# EasyEDA Pro project 蓝桥4ASCII-1.epro, board 蓝桥4ASCII
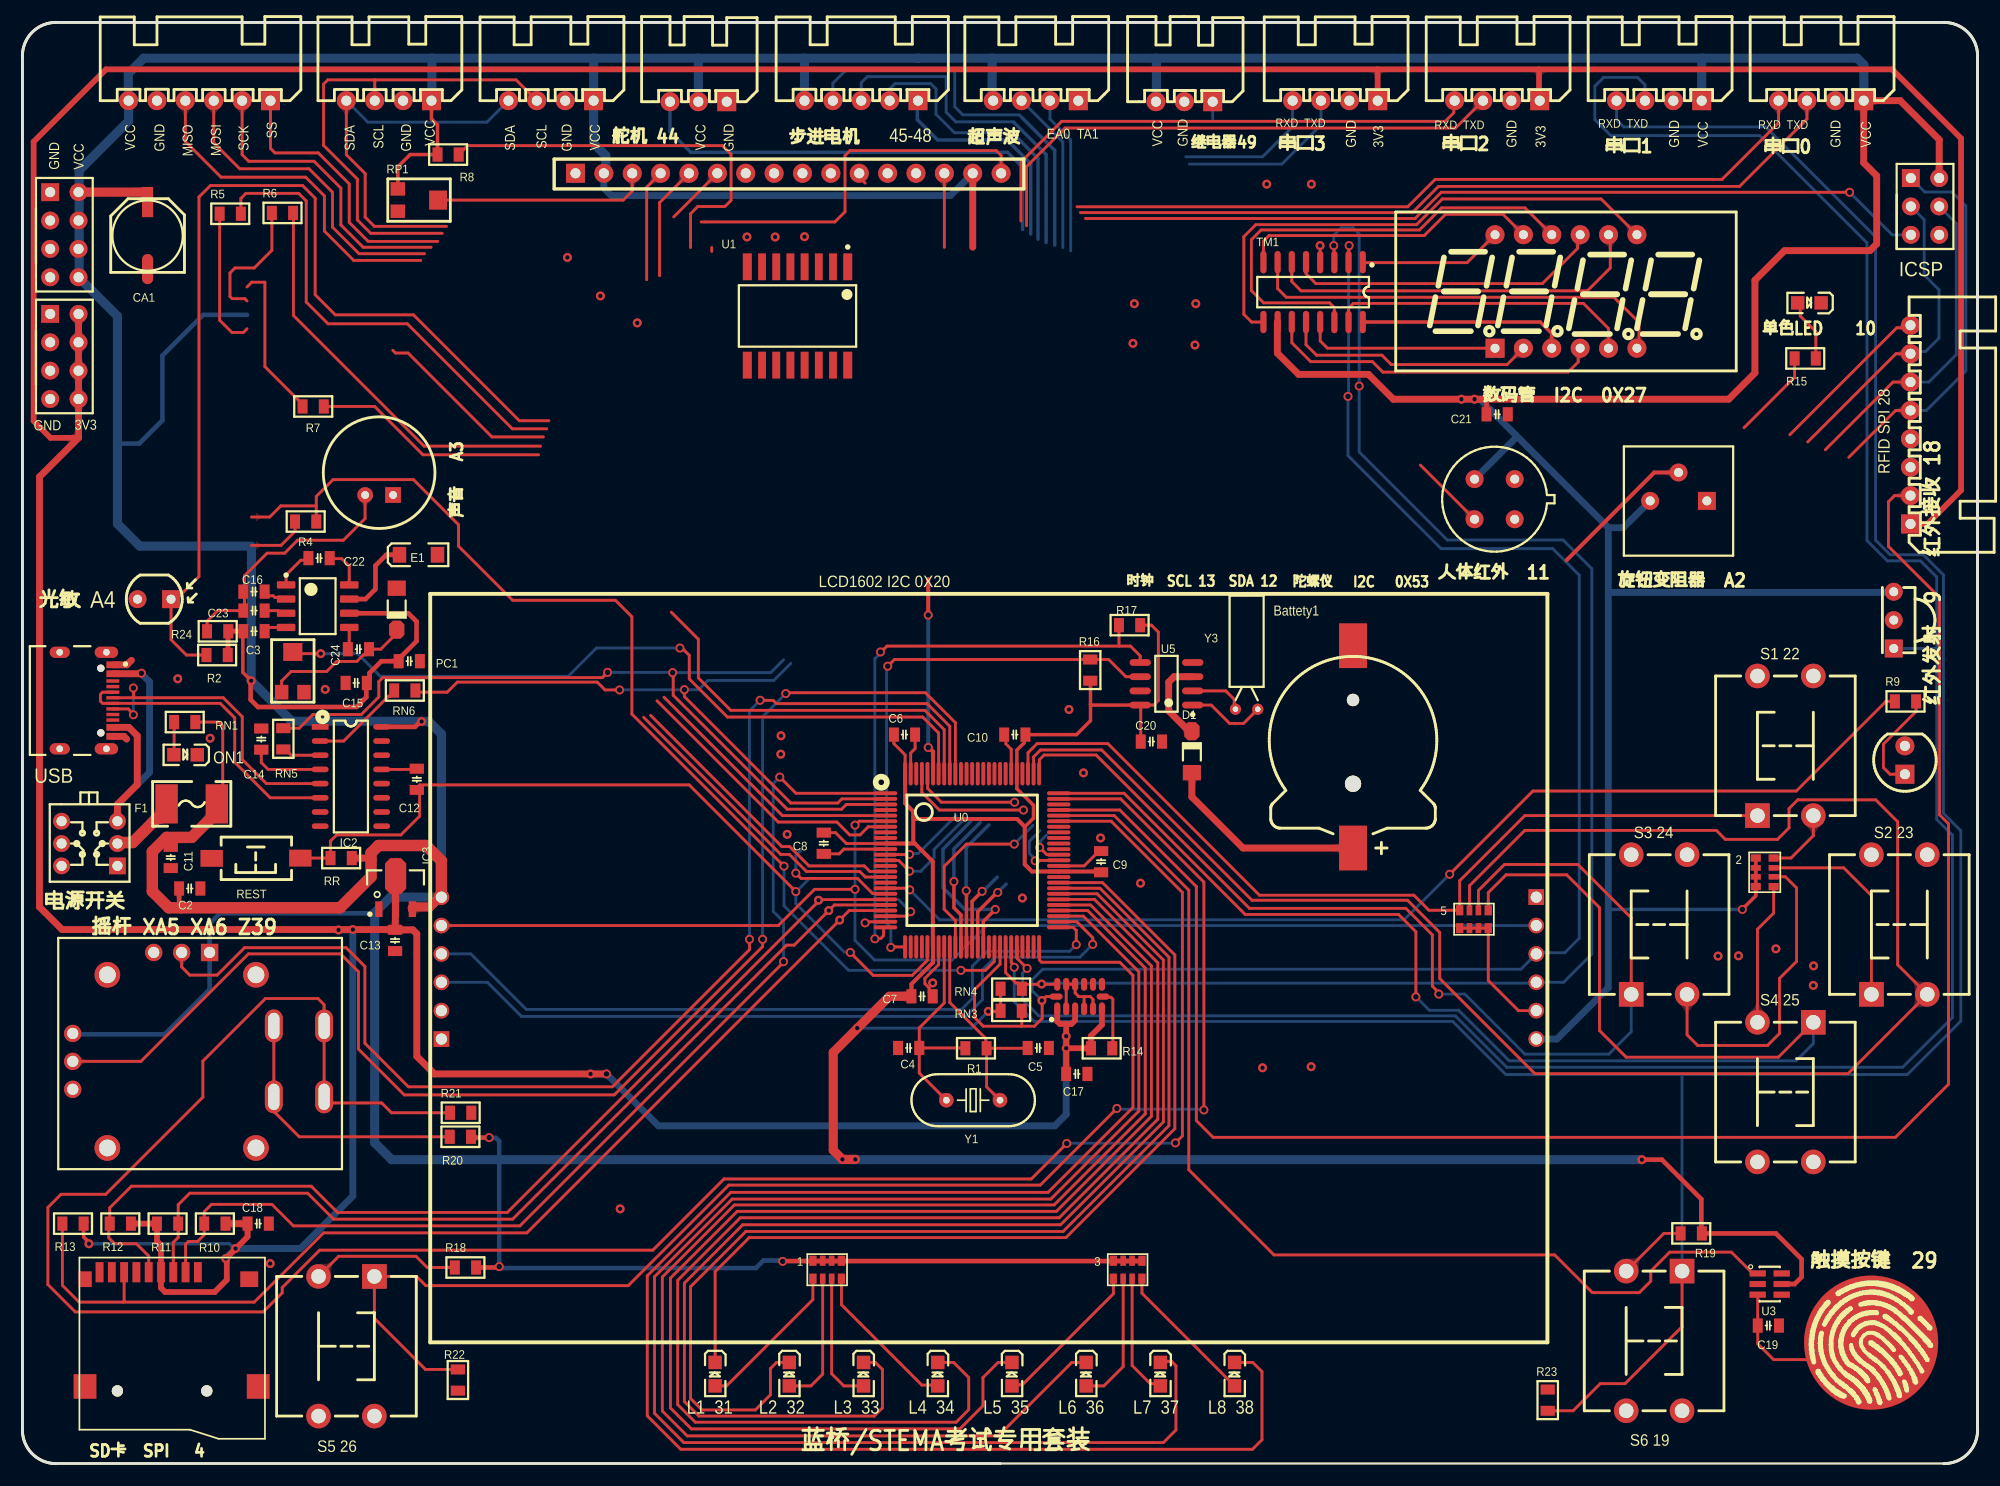
[diagram p0: board, top side]
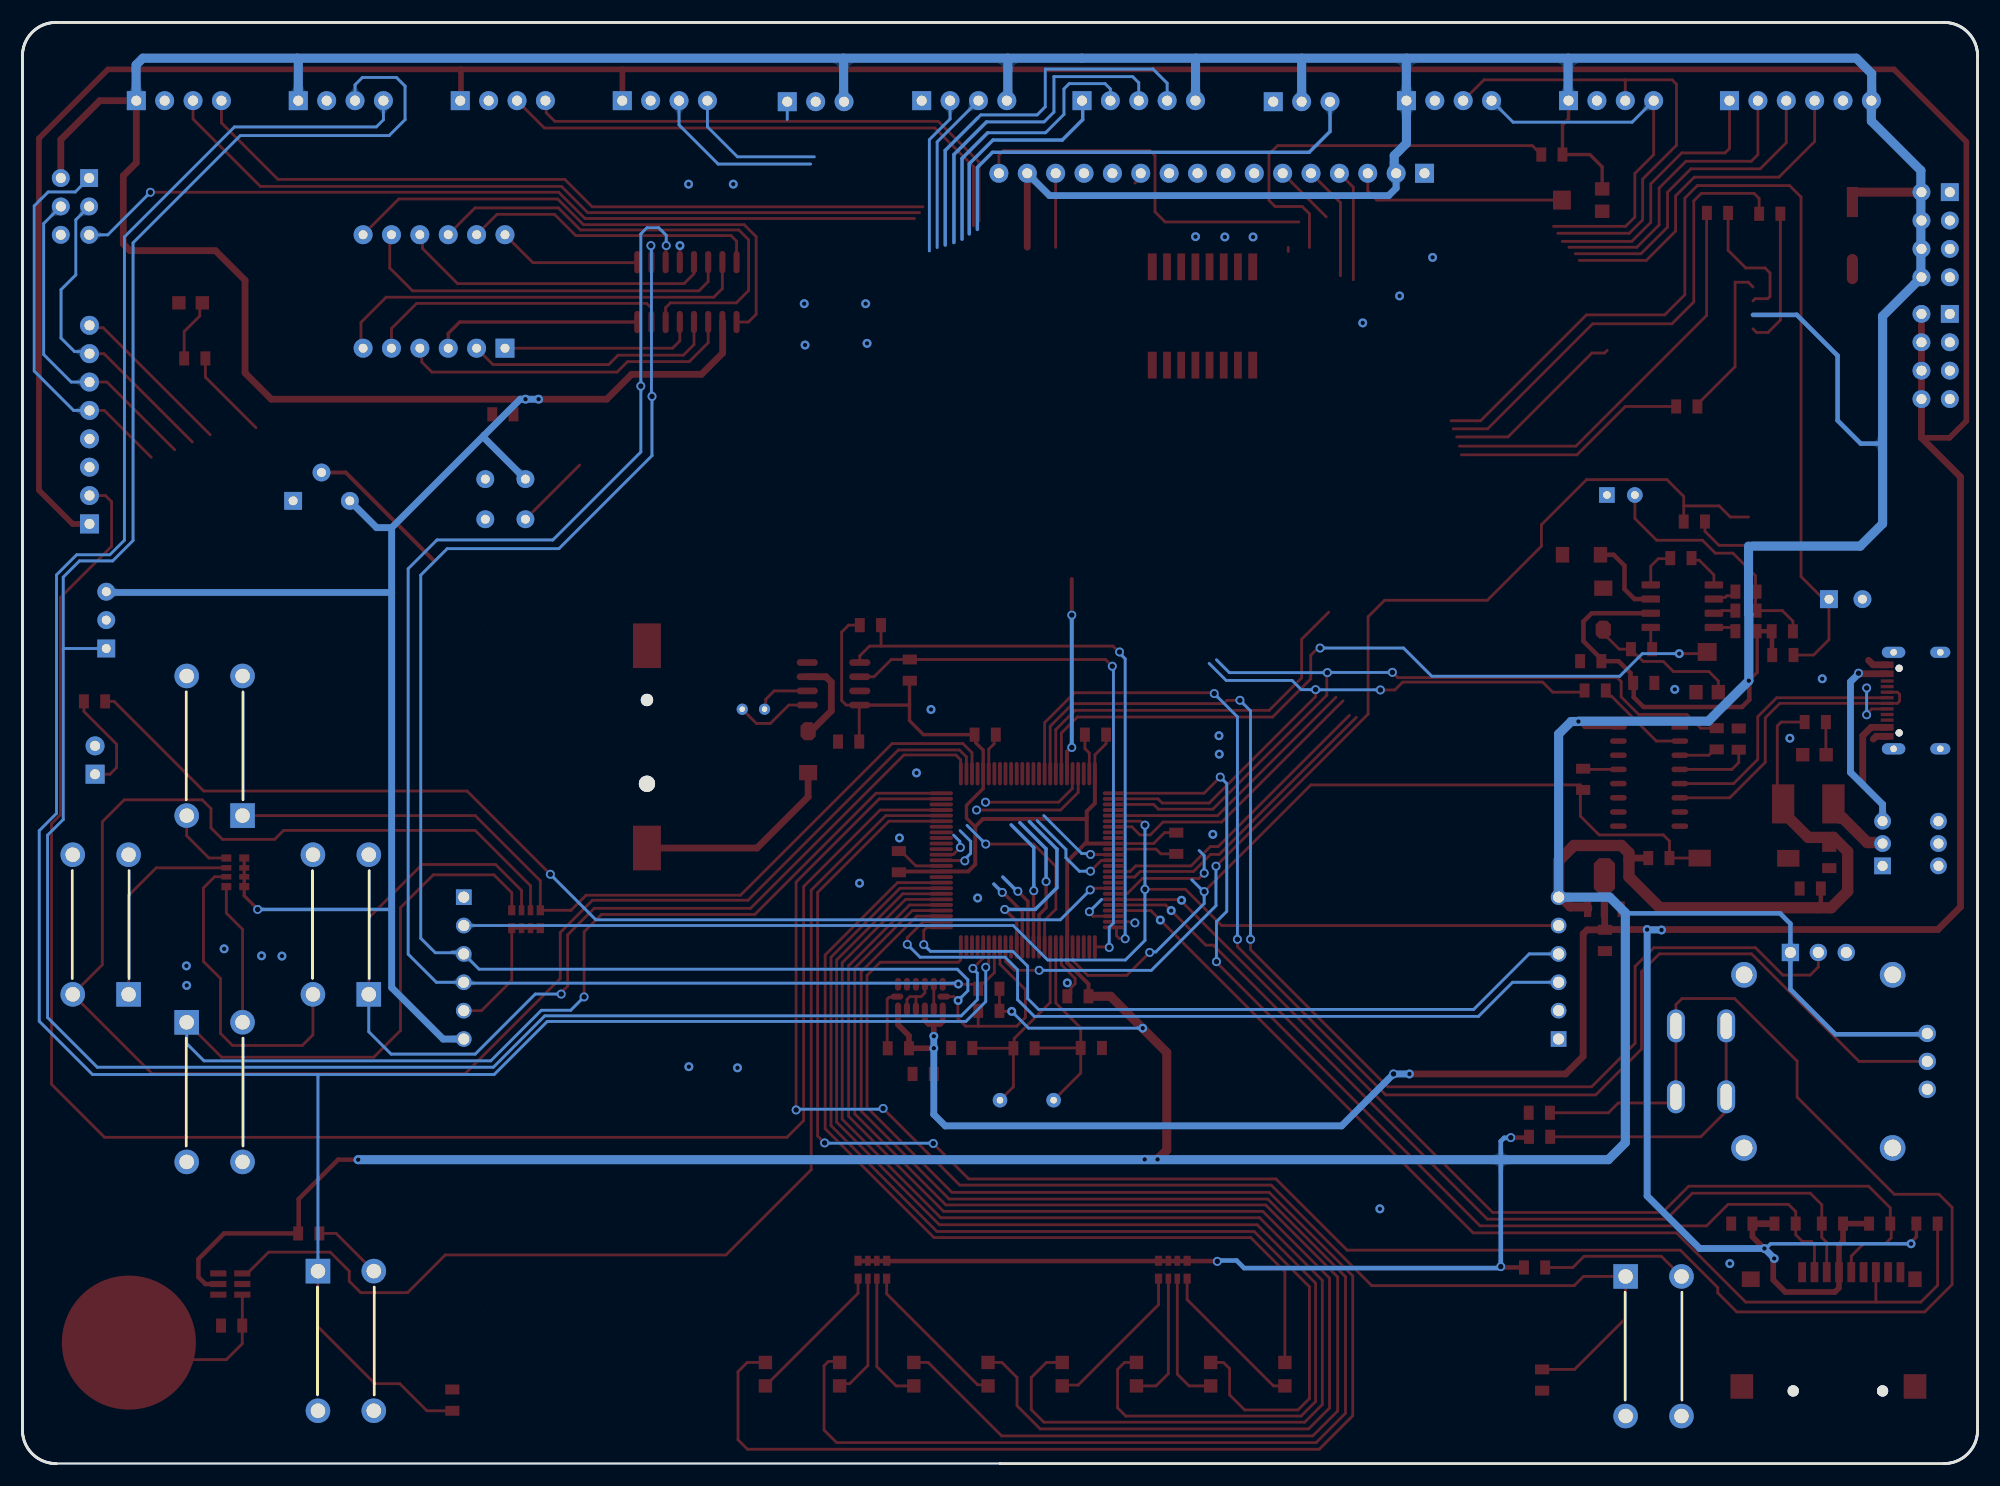
[diagram p1: board, bottom side, seen from below]

Outline 175.02 x 129.02 mm; copper layers: Top Layer, Bottom Layer. Coordinates in mm from the lower left corner of the outline.
Outline path: 0.01,3.01 0,3.01 arc(0.88,0.88) 3.01,0 3.01,0.01 ; 0.01,3.01 0.01,126.01 ; 0.01,3.01 0.01,126.01 ; 0.01,3.01 arc(0.89,0.89) 3.01,0.01 ; 0.01,126.01 0,126.01 arc(0.88,128.14) 3.01,129.02 3.01,129.01 ; 0.01,126.01 arc(0.89,128.13) 3.01,129.01 ; 3.01,129.01 172.01,129.01 arc(174.13,128.13) 175.01,126.01 175.01,3.01 ; 3.01,129.01 172.02,129.01 172.01,129.02 arc(174.14,128.14) 175.02,126.01 175.01,126.02 ; 3.01,0.01 172.01,0.01 ; 172.01,0.01 172.01,0 arc(174.14,0.88) 175.02,3.01 175.01,3.01 ; 172.01,0.01 arc(174.13,0.89) 175.01,3.01 ; 175.01,126.02 175.01,3.01 ; 175.01,126.02 175.01,3.01
Stack: Top Layer 0.0356mm / Dielectric 1 0.32mm FR-4 er 4.8 / Bottom Layer 0.0356mm

## Design rules (mm)
spacing Clearance_1: track to track 0.305, other pairs 0.305 to 0.305
spacing Clearance (default): track to track 0.127, other pairs 0.127 to 0.127
track width Width (default): min 0.127, default 0.254, max 2.032
differential pair DiffPairsRouting (default): width min 0.381, default 0.381, max 0.381; gap min 0.254, default 0.254
via RoutingVias (default): diameter min 0.5, default 0.8, max 1.27; hole min 0.3, default 0.5, max 0.711

## Placement (name value [footprint] x y rotation side)
1  -  [RCA-8P4R-0603]  72.04 17.36 0 top
2  -  [RCA-8P4R-0603]  155.96 52.94 270 top
3  -  [RCA-8P4R-0603]  98.94 17.36 0 top
5  -  [RCA-8P4R-0603]  129.94 48.74 0 top
C2  -  [C 0805_L]  14.99 51.49 180 top
C3  -  [C 0805_L]  20.74 74.52 180 top
C4  -  [C 0805_L]  79.34 37.21 0 top
C5  -  [C 0805_L]  90.94 37.21 180 top
C6  -  [C 0805_L]  78.96 65.26 0 top
C7  -  [C 0805_L]  80.54 41.84 0 top
C8  -  [C 0805_L]  71.74 55.54 270 top
C9  -  [C 0805_L]  96.56 53.89 90 top
C10  -  [C 0805_L]  88.84 65.26 180 top
C11  -  [C 0805_L]  13.29 54.26 90 top
C12  -  [C 0805_L]  35.31 61.26 90 top
C13  -  [C 0805_L]  33.36 46.84 90 top
C14  -  [C 0805_L]  21.39 64.86 270 top
C15  -  [C 0805_L]  29.89 69.89 180 top
C16  -  [C 0805_L]  20.74 78.06 180 top
C17  -  [C 0805_L]  94.39 34.89 0 top
C18  -  [C 0805_L]  21.11 21.49 180 top
C19  -  [C 0805_L]  156.29 12.36 180 top
C20  -  [C 0805_L]  101.06 64.64 0 top
C21  -  [C 0805_L]  132.01 93.94 180 top
C22  -  [C 0805_L]  26.56 81.06 180 top
C23  -  [C 0805_L]  20.74 76.36 0 top
C24  -  [C 0805_L]  30.09 72.91 0 top
CA1  -  [CM D(6.3*5.4)]  11.21 109.94 90 top
CR1  -  [CR1220_A]  119.11 64.76 270 top
D1  -  [MINI_MELF (LL34)]  104.69 63.71 90 top
DZ1  -  [MINI_MELF (LL34)]  33.51 76.51 270 top
E1  -  [CD A(3216)]  35.46 81.36 0 top
F1  -  [FU 1812]  15.16 59.06 180 top
IC2  -  [SOP16_L]  29.41 61.51 0 top
IC3  -  [SOT89_N]  33.41 51.59 0 top
ICSP  -  [HDR2.54-LI-2X3P]  170.31 112.54 270 top
JP1  -  [HDR2.54-LI-2X4P]  3.76 110.01 270 top
JP2  -  [HDR2.54-LI-2X4P]  3.76 99.11 270 top
JP3  -  [XH2.54-WI-6P]  15.86 122.01 180 top
JP4  -  [XH2.54-WI-4P]  32.81 122.01 180 top
JP5  -  [XH2.54-WI-4P]  47.32 122.01 180 top
LCD1602 I2C 0X20  -  [LCD-1602]  49.51 115.51 0 top
LED1  -  [LUMX-SML-LXT0805_V]  62.01 8.01 90 top
LED2  -  [LUMX-SML-LXT0805_V]  68.65 8.01 90 top
LED3  -  [LUMX-SML-LXT0805_V]  75.3 8.01 90 top
LED4  -  [LUMX-SML-LXT0805_V]  81.94 8.01 90 top
LED5  -  [LUMX-SML-LXT0805_V]  88.58 8.01 90 top
LED6  -  [LUMX-SML-LXT0805_V]  95.22 8.01 90 top
LED7  -  [LUMX-SML-LXT0805_V]  101.87 8.01 90 top
LED8  -  [LUMX-SML-LXT0805_V]  108.51 8.01 90 top
LED9  -  [LUMX-SML-LXT0805_V]  14.61 63.46 0 top
LED10  -  [LUMX-SML-LXT0805_V]  159.96 103.91 0 top
M1  -  [3MM螺柱#2]  173.11 2.55 0 top
M2  -  [3MM螺柱#3]  2.55 2.55 0 top
M3  -  [3MM螺柱]  2.55 125.61 0 top
M4  -  [3MM螺柱#4]  171.46 126.63 0 top
PC1  -  [C 0805_L]  34.64 71.84 180 top
R1  -  [R 0805_L]  85.36 37.19 0 top
R2  -  [R 0805_L]  17.44 72.39 180 top
R4  -  [R 0805_L]  25.36 84.34 0 top
R5  -  [R 0805_L]  18.61 111.89 0 top
R6  -  [R 0805_L]  23.29 111.96 0 top
R7  -  [R 0805_L]  26.04 94.64 0 top
R8  -  [R 0805_L]  38.11 117.19 0 top
R9  -  [R 0805_L]  168.56 68.24 0 top
R10  -  [R 0805_L]  17.23 21.49 180 top
R11  -  [R 0805_L]  13 21.49 180 top
R12  -  [R 0805_L]  8.77 21.49 0 top
R13  -  [R 0805_L]  4.54 21.49 0 top
R14  -  [R 0805_L]  96.61 37.19 180 top
R15  -  [R 0805_L]  159.59 98.94 0 top
R16  -  [R 0805_L]  95.59 71.04 270 top
R17  -  [R 0805_L]  99.11 75.06 0 top
R18  -  [R 0805_L]  39.66 17.56 0 top
R19  -  [R 0805_L]  149.39 20.61 180 top
R20  -  [R 0805_L]  39.21 29.26 180 top
R21  -  [R 0805_L]  39.24 31.41 0 top
R22  -  [R 0805_L]  38.99 7.49 90 top
R23  -  [R 0805_L]  136.54 5.69 270 top
R24  -  [R 0805_L]  17.49 74.51 0 top
REST  -  [TSW SMD-3*6*2.5]  20.89 54.19 180 top
RFID SPI 28  -  [XH2.54-WI-8P]  169.01 93.01 90 top
RN1  -  [R 0805_L]  14.54 66.39 180 top
RN3  -  [R 0805_L]  88.51 40.54 0 top
RN4  -  [R 0805_L]  88.51 42.51 0 top
RN5  -  [R 0805_L]  23.36 64.89 90 top
RN6  -  [R 0805_L]  34.24 69.21 0 top
RP1  -  [3303W]  35.41 113.11 270 top
RP2  -  [3303W]  24.21 70.86 0 top
RR  -  [R 0805_L]  28.54 54.21 180 top
S1 22  -  [TSW DIP-12*12*4.3]  157.81 64.26 90 top
S2 23  -  [TSW DIP-12*12*4.3]  168.01 48.26 90 top
S3 24  -  [TSW DIP-12*12*4.3]  146.51 48.26 90 top
S4 25  -  [TSW DIP-12*12*4.3]  157.81 33.26 270 top
S5 26  -  [TSW DIP-12*12*4.3]  29.01 10.51 270 top
S6 19  -  [TSW DIP-12*12*4.3]  146.06 10.99 270 top
SD卡  SPI   4  -  [Micro SD]  12.51 6.51 0 top
TM1  -  [SOP16]  115.54 104.89 270 top
U0  -  [LQFP100 14x14_M]  85.01 54.01 270 top
U1  -  [FP-SOT162-1-MFG]  69.39 102.74 270 top
U3  -  [SOT23-6]  156.41 16.08 90 top
U4  -  [ADI-CC-14-1_V]  94.64 41.81 90 top
U5  -  [S8+2_L]  102.41 69.81 180 top
U6  -  [D0008A_M]  26.44 76.76 0 top
USB  -  [FP-USB4105-GF-A-MFG]  4.51 68.31 270 top
Y1  -  [OSC HC-49S]  85.11 32.54 0 top
Y3  -  [OSC-3x8-WI-A]  109.59 67.54 0 top
串口0  -  [XH2.54-WI-4P]  161.01 122.01 180 top
串口1  -  [XH2.54-WI-4P]  146.51 122.01 180 top
串口2  -  [XH2.54-WI-4P]  132.01 122.01 180 top
串口3  -  [XH2.54-WI-4P]  117.51 122.01 180 top
人体红外  11  -  [BM412]  131.79 86.34 315 top
光敏  -  [RG5528]  11.81 77.39 180 top
声音   A3  -  [MIC]  31.94 88.71 270 top
摇杆 XA5 XA6 Z39  -  [FP-RKJXK122400Y-MFG]  14.26 36.01 90 top
数码管  I2C  0X27  -  [SMG 0.36-4P]  138.17 104.93 0 top
旋钮变阻器  A2  -  [FP-3386P-MFG]  148.25 86.17 180 top
步进电机  -  [XH2.54-WI-5P]  75.09 122.01 180 top
电源开关  -  [KFT DIP-7X7]  6.01 55.51 90 top
红外发射  9  -  [I-LED-5MM]  168.51 62.99 90 top
红外接收 18  -  [VS1838B-B]  167.51 75.51 90 top
继电器49  -  [XH2.54-WI-3P]  104.01 121.92 180 top
舵机 44  -  [XH2.54-WI-3P]  60.51 121.92 180 top
触摸屏  -  [触摸屏]  86.51 44.36 0 top
触摸按键  29  -  [TOUCH]  165.49 10.84 45 top
超声波  -  [XH2.54-WI-4P]  90.71 122.01 180 top

## Footprints (pads in the part's own frame, mm; a bottom-side part is the same pattern mirrored in y, then rotated)
3MM螺柱
  round 0.013 hole 3: 0(0,0.857)
3MM螺柱#2
  round 0.013 hole 3: 0(-0.641,0)
3MM螺柱#3
  round 0.013 hole 3: 0(0,0)
3MM螺柱#4
  round 0.013 hole 3: 0(1.01,-0.159)
3303W
  rect 1.2x1.3 smd: 1(-1,-1.8) 3(1,-1.8)
  rect 1.7x1.6 smd: 2(0,1.8)
ADI-CC-14-1_V
  oval 1.145x0.55 smd: 1(-1.097,2) 2(-1.097,1.2) 3(-1.097,0.4) 4(-1.097,-0.4) 5(-1.097,-1.2) 6(-1.097,-2) 8(1.097,-2) 9(1.097,-1.2) 10(1.097,-0.4) 11(1.097,0.4) 12(1.097,1.2) 13(1.097,2)
  oval 0.55x1.145 smd: 7(0,-2.098) 14(0,2.098)
BM412
  round 1.6 hole 0.8: 1(2.54,0) 2(0,2.54) 3(-2.54,0) 4(0,-2.54)
C 0805_L
  rect 0.889x1.27 smd: 1(-0.95,0) 2(0.95,0)
CD A(3216)
  rect 1.2x1.4 smd: 1(-1.7,0) 2(1.7,0)
CM D(6.3*5.4)
  rect 2.7x1 smd: 1(3,0)
  oval 2.7x1 smd: 2(-3,0)
CR1220_A
  round 1.1 hole 1.1: 0(-3.6,0)
  round 1.45 hole 1.45: 0(3.9,0)
  rect 4x2.5 smd: 1(9.652,0) 2(-8.458,0)
D0008A_M
  rrect 1.65x0.65 smd: 1(-2.825,1.905) 2(-2.825,0.635) 3(-2.825,-0.635) 4(-2.825,-1.905) 5(2.825,-1.905) 6(2.825,-0.635) 7(2.825,0.635) 8(2.825,1.905)
FP-3386P-MFG
  rect 1.6x1.6 hole 0.8: 1(-2.54,-0.015)
  round 1.6 hole 0.8: 2(0,-2.555) 3(2.54,-0.015)
FP-RKJXK122400Y-MFG
  round 2.3 hole 1.5: 1(-7.75,6.65) 2(7.75,6.65) 3(-7.75,-6.65) 4(7.75,-6.65)
  rect 1.55x1.55 hole 1: 1_VR1(9.75,-2.5)
  round 1.55 hole 1: 1_VR2(2.5,9.75) 2_VR1(9.75,0) 2_VR2(0,9.75) 3_VR1(9.75,2.5) 3_VR2(-2.5,9.75)
  rrect 2.95x1.6 hole 2.35x1: a(-3.175,-8.25) b(-3.175,-12.75) c(3.175,-8.25) d(3.175,-12.75)
FP-SOT162-1-MFG
  rect 2.4x0.8 smd: 1(-4.4,4.495) 8(-4.4,-4.495) 9(4.4,-4.495) 16(4.4,4.495)
  rect 2.4x0.7 smd: 2(-4.4,3.175) 3(-4.4,1.905) 4(-4.4,0.635) 5(-4.4,-0.635) 6(-4.4,-1.905) 7(-4.4,-3.175) 10(4.4,-3.175) 11(4.4,-1.905) 12(4.4,-0.635) 13(4.4,0.635) 14(4.4,1.905) 15(4.4,3.175)
FP-USB4105-GF-A-MFG
  rrect 1x2.1 hole 0.6: 1(-4.32,3.015) 2(4.32,3.015)
  rrect 1x1.8 hole 0.6: 3(-4.32,-1.165) 4(4.32,-1.165)
  round 0.65 hole 0.65: 5(2.89,2.515) 6(-2.89,2.515)
  rect 0.6x1.15 smd: A1-B12(-3.2,3.59) A4-B9(-2.4,3.59) B1-A12(3.2,3.59) B4-A9(2.4,3.59)
  rect 0.3x1.15 smd: A5(-1.25,3.59) A6(-0.25,3.59) A7(0.25,3.59) A8(1.25,3.59) B5(1.75,3.59) B6(0.75,3.59) B7(-0.75,3.59) B8(-1.75,3.59)
FU 1812
  rect 2x3.5 smd: 1(-2.25,0) 2(2.25,0)
HDR2.54-LI-2X3P
  rect 1.6x1.6 hole 0.9: 1(-2.54,-1.27)
  round 1.6 hole 0.9: 2(-2.54,1.27) 3(0,-1.27) 4(0,1.27) 5(2.54,-1.27) 6(2.54,1.27)
HDR2.54-LI-2X4P
  rect 1.6x1.6 hole 0.9: 1(-3.81,-1.27)
  round 1.6 hole 0.9: 2(-3.81,1.27) 3(-1.27,-1.27) 4(-1.27,1.27) 5(1.27,-1.27) 6(1.27,1.27) 7(3.81,-1.27) 8(3.81,1.27)
I-LED-5MM
  rect 1.7x1.7 hole 0.9: 1(-1.27,0)
  round 1.7 hole 0.9: 2(1.27,0)
KFT DIP-7X7
  rect 1.5x1.5 hole 0.9: 1(-2,-2.5)
  round 1.5 hole 0.9: 2(0,-2.5) 3(2,-2.5) 4(2,2.5) 5(0,2.5) 6(-2,2.5)
LCD-1602
  round 0.013 hole 3: 0(-5.5,0) 0(-5.5,-31) 0(69.5,0) 0(69.5,-31)
  rect 1.7x1.7 hole 0.9: 1(0,0)
  round 1.7 hole 0.9: 2(2.54,0) 3(5.08,0) 4(7.62,0) 5(10.16,0) 6(12.7,0) 7(15.24,0) 8(17.78,0) 9(20.32,0) 10(22.86,0) 11(25.4,0) 12(27.94,0) 13(30.48,0) 14(33.02,0) 15(35.56,0) 16(38.1,0)
LQFP100 14x14_M
  oval 0.35x2.1 smd: 1(-6,-7.747) 2(-5.5,-7.747) 3(-5,-7.747) 4(-4.5,-7.747) 5(-4,-7.747) 6(-3.5,-7.747) 7(-3,-7.747) 8(-2.5,-7.747) 9(-2,-7.747) 10(-1.5,-7.747) 11(-1,-7.747) 12(-0.5,-7.747) 13(0,-7.747) 14(0.5,-7.747) 15(1,-7.747) 16(1.5,-7.747) 17(2,-7.747) 18(2.5,-7.747) 19(3,-7.747) 20(3.5,-7.747) 21(4,-7.747) 22(4.5,-7.747) 23(5,-7.747) 24(5.5,-7.747) 25(6,-7.747) 51(6,7.758) 52(5.5,7.758) 53(5,7.758) 54(4.5,7.758) 55(4,7.758) 56(3.5,7.758) 57(3,7.758) 58(2.5,7.758) 59(2,7.758) 60(1.5,7.758) 61(1,7.758) 62(0.5,7.758) 63(0,7.758) 64(-0.5,7.758) 65(-1,7.758) 66(-1.5,7.758) 67(-2,7.758) 68(-2.5,7.758) 69(-3,7.758) 70(-3.5,7.758) 71(-4,7.758) 72(-4.5,7.758) 73(-5,7.758) 74(-5.5,7.758) 75(-6,7.758)
  oval 2.1x0.35 smd: 26(7.753,-5.995) 27(7.753,-5.495) 28(7.753,-4.995) 29(7.753,-4.495) 30(7.753,-3.994) 31(7.753,-3.494) 32(7.753,-2.994) 33(7.753,-2.494) 34(7.753,-1.994) 35(7.753,-1.494) 36(7.753,-0.995) 37(7.753,-0.494) 38(7.753,0.005) 39(7.753,0.505) 40(7.753,1.006) 41(7.753,1.506) 42(7.753,2.006) 43(7.753,2.506) 44(7.753,3.006) 45(7.753,3.506) 46(7.753,4.005) 47(7.753,4.505) 48(7.753,5.005) 49(7.753,5.505) 50(7.753,6.005) 76(-7.753,6.005) 77(-7.753,5.505) 78(-7.753,5.005) 79(-7.753,4.505) 80(-7.753,4.005) 81(-7.753,3.506) 82(-7.753,3.006) 83(-7.753,2.506) 84(-7.753,2.006) 85(-7.753,1.506) 86(-7.753,1.006) 87(-7.753,0.505) 88(-7.753,0.005) 89(-7.753,-0.494) 90(-7.753,-0.995) 91(-7.753,-1.494) 92(-7.753,-1.994) 93(-7.753,-2.494) 94(-7.753,-2.994) 95(-7.753,-3.494) 96(-7.753,-3.994) 97(-7.753,-4.495) 98(-7.753,-4.995) 99(-7.753,-5.495) 100(-7.753,-5.995)
LUMX-SML-LXT0805_V
  rect 1.2x1.2 smd: 1(-1.05,0) 2(1.05,0)
MIC
  rect 1.4x1.4 hole 0.7: 1(2,1.25)
  round 1.4 hole 0.7: 2(2,-1.25)
Micro SD
  round 1 hole 1: 0(-4,0) 0(4,0)
  rect 0.7x1.8 smd: 1(3.2,10.627) 2(2.1,10.627) 3(1,10.627) 4(-0.1,10.627) 5(-1.2,10.627) 6(-2.3,10.627) 7(-3.4,10.627) 8(-4.5,10.627) 9(-5.6,10.627)
  rect 1.2x1.4 smd: 10(-6.9,10)
  rect 2.032x2.2 smd: 10(-6.9,0.4) 10(8.6,0.4)
  rect 1.6x1.4 smd: 10(7.8,10)
MINI_MELF (LL34)
  rect 1.37x1.62 smd: 1(-1.855,0)
  custom 0x0 smd: 2(1.855,0)
OSC HC-49S
  round 1.3 hole 0.6: 1(-2.4,0) 2(2.4,0)
OSC-3x8-WI-A
  round 1 hole 0.5: 1(1,0) 2(-1,0)
R 0805_L
  rect 0.889x1.27 smd: 1(-0.95,0) 2(0.95,0)
RCA-8P4R-0603
  rect 0.65x0.9 smd: 1(-1.28,-0.8) 4(1.28,-0.8) 5(1.28,0.8) 8(-1.28,0.8)
  rect 0.5x0.9 smd: 2(-0.4,-0.8) 3(0.4,-0.8) 6(0.4,0.8) 7(-0.4,0.8)
RG5528
  rect 1.6x1.6 hole 0.8: 1(-1.5,0)
  round 1.6 hole 0.8: 2(1.5,0)
S8+2_L
  oval 1.9x0.6 smd: 1(-2.35,1.905) 2(-2.35,0.635) 3(-2.35,-0.635) 4(-2.35,-1.905) 5(2.35,-1.905) 6(2.35,-0.635) 7(2.35,0.635) 8(2.35,1.905)
SMG 0.36-4P
  rect 1.7x1.7 hole 0.8: 1(-6.35,-5.08)
  round 1.7 hole 0.8: 2(-3.81,-5.08) 3(-1.27,-5.08) 4(1.27,-5.08) 5(3.81,-5.08) 6(6.35,-5.08) 7(6.35,5.08) 8(3.81,5.08) 9(1.27,5.08) 10(-1.27,5.08) 11(-3.81,5.08) 12(-6.35,5.08)
SOP16
  oval 2x0.55 smd: 1(-2.667,4.445) 2(-2.667,3.175) 3(-2.667,1.905) 4(-2.667,0.635) 5(-2.667,-0.635) 6(-2.667,-1.905) 7(-2.667,-3.175) 8(-2.667,-4.445) 9(2.692,-4.445) 10(2.692,-3.175) 11(2.692,-1.905) 12(2.692,-0.635) 13(2.692,0.635) 14(2.692,1.905) 15(2.692,3.175) 16(2.692,4.445)
SOP16_L
  rect 1.5x0.5 smd: 1(-2.752,4.445)
  oval 1.5x0.5 smd: 2(-2.752,3.175) 3(-2.752,1.905) 4(-2.752,0.635) 5(-2.752,-0.635) 6(-2.752,-1.905) 7(-2.752,-3.175) 8(-2.752,-4.445) 9(2.752,-4.445) 10(2.752,-3.175) 11(2.752,-1.905) 12(2.752,-0.635) 13(2.752,0.635) 14(2.752,1.905) 15(2.752,3.175) 16(2.752,4.445)
SOT23-6
  rect 0.55x1.45 smd: 1(0.95,1.075) 2(0,1.075) 3(-0.95,1.075) 4(-0.95,-1.075) 5(0,-1.075) 6(0.95,-1.075)
SOT89_N
  rect 0.65x1.4 smd: 1(-1.5,-1.952) 3(1.5,-1.952)
  custom 0x0 smd: 2(0,1.016)
  rect 0.65x2.1 smd: 2(0,-1.625)
TOUCH
  round 12 smd: 1(0,0)
TSW DIP-12*12*4.3
  rect 2.2x2.2 hole 1.3: 1(-6.25,2.5)
  round 2.2 hole 1.3: 2(-6.25,-2.5) 3(6.25,-2.5) 4(6.25,2.5)
TSW SMD-3*6*2.5
  rect 2x1.5 smd: 1(-3.996,-0.02) 2(3.937,0)
VS1838B-B
  rect 1.6x1.6 hole 0.8: 1(-2.54,0)
  round 1.6 hole 0.8: 2(0,0) 3(2.54,0)
XH2.54-WI-3P
  rect 1.7x1.7 hole 0.9: 1(-2.54,0)
  round 1.7 hole 0.9: 2(0,0) 3(2.54,0)
XH2.54-WI-4P
  rect 1.7x1.7 hole 0.9: 1(-3.81,0)
  round 1.7 hole 0.9: 2(-1.27,0) 3(1.27,0) 4(3.81,0)
XH2.54-WI-5P
  rect 1.7x1.7 hole 0.9: 1(-5.08,0)
  round 1.7 hole 0.9: 2(-2.54,0) 3(0,0) 4(2.54,0) 5(5.08,0)
XH2.54-WI-6P
  rect 1.7x1.7 hole 0.9: 1(-6.35,0)
  round 1.7 hole 0.9: 2(-3.81,0) 3(-1.27,0) 4(1.27,0) 5(3.81,0) 6(6.35,0)
XH2.54-WI-8P
  rect 1.7x1.7 hole 0.9: 1(-8.89,0)
  round 1.7 hole 0.9: 2(-6.35,0) 3(-3.81,0) 4(-1.27,0) 5(1.27,0) 6(3.81,0) 7(6.35,0) 8(8.89,0)
触摸屏
  round 0.013 hole 3: 0(-47.25,30.75) 0(-47.25,-30.75) 0(46,24.25) 0(47.25,30.75) 0(47.25,-30.75)
  rect 1.4x1.4 hole 1: 1(-49,-6.35) 12(49,6.35)
  round 1.4 hole 1: 2(-49,-3.81) 3(-49,-1.27) 4(-49,1.27) 5(-49,3.81) 6(-49,6.35) 7(49,-6.35) 8(49,-3.81) 9(49,-1.27) 10(49,1.27) 11(49,3.81)

## Nets
GND: 5.1 5.2 5.3 5.4 C2.1 C3.1 C4.1 C5.1 C6.2 C7.2 C8.2 C9.2 C10.2 C11.1 C13.1 C14.1 C15.2 C16.1 C17.2 C18.1 C19.1 C20.2 C21.1 CA1.2 CR1.2 DZ1.1 E1.2 IC2.1 IC3.1 ICSP.6 JP1.1 JP1.3 JP1.5 JP1.7 JP2.1 JP2.3 JP2.5 JP2.7 JP3.5 JP4.2 JP5.2 LCD1602 I2C 0X20.1 LED9.2 LED10.2 PC1.1 R21.2 R22.1 R23.1 REST.2 RFID SPI 28.3 RFID SPI 28.4 RP1.3 RP2.3 SD卡  SPI   4.6 SD卡  SPI   4.10 TM1.4 U0.11 U0.32 U0.62 U0.81 U0.99 U1.1 U1.2 U1.3 U1.8 U3.2 U3.4 U3.6 U4.2 U4.4 U4.5 U4.11 U4.12 U5.4 U6.2 U6.4 USB.A1-B12 USB.B1-A12 串口0.2 串口1.2 串口2.2 串口3.2 人体红外  11.1 人体红外  11.2 光敏.2 声音   A3.1 摇杆 XA5 XA6 Z39.1 摇杆 XA5 XA6 Z39.2 摇杆 XA5 XA6 Z39.3 摇杆 XA5 XA6 Z39.3_VR1 摇杆 XA5 XA6 Z39.3_VR2 摇杆 XA5 XA6 Z39.4 旋钮变阻器  A2.1 红外发射  9.2 红外接收 18.2 继电器49.2 舵机 44.1 触摸屏.1 触摸屏.8 超声波.1
+3.3: C13.2 C17.1 C18.2 IC3.2 JP2.2 JP2.4 JP2.6 JP2.8 R10.1 R11.2 R12.2 R13.2 R14.2 RFID SPI 28.1 SD卡  SPI   4.4 U4.1 U4.3 U4.6 串口2.1 串口3.1
+5: 1.5 1.6 1.7 1.8 2.1 2.2 2.3 2.4 3.5 3.6 3.7 3.8 C2.2 C3.2 C6.1 C7.1 C8.1 C9.1 C10.1 C11.2 C15.1 C20.1 C21.2 CA1.1 F1.1 IC2.16 IC3.3 ICSP.2 JP1.2 JP1.4 JP1.6 JP1.8 JP3.6 JP4.1 JP5.1 LCD1602 I2C 0X20.2 LCD1602 I2C 0X20.15 PC1.2 R2.1 R4.1 R8.1 R16.2 R17.2 R18.2 R19.1 R20.1 R24.2 RN1.1 RN3.1 RN4.1 RP1.1 RR.1 TM1.10 U0.10 U0.31 U0.61 U0.80 U0.100 U1.16 U3.5 U5.8 U6.6 串口0.1 串口1.1 人体红外  11.3 摇杆 XA5 XA6 Z39.1_VR1 摇杆 XA5 XA6 Z39.1_VR2 旋钮变阻器  A2.3 步进电机.5 红外接收 18.3 继电器49.3 舵机 44.2 触摸屏.6 触摸屏.7 超声波.4
MISO: ICSP.1 JP3.4 R13.1 RFID SPI 28.5 SD卡  SPI   4.7 U0.22
MOSI: ICSP.4 JP3.3 R11.1 RFID SPI 28.6 SD卡  SPI   4.3 U0.21
NET1_1: 1.1 LED1.1
NET1_2: 1.2 LED2.1
NET1_3: 1.3 LED3.1
NET1_4: 1.4 LED4.1
NET2_5: 2.5 S4 25.2
NET2_6: 2.6 S3 24.2
NET2_7: 2.7 S2 23.1
NET2_8: 2.8 S1 22.2
NET3_1: 3.1 LED5.1
NET3_2: 3.2 LED6.1
NET3_3: 3.3 LED7.1
NET3_4: 3.4 LED8.1
NETC4_2: C4.2 R1.1 U0.33 Y1.1
NETC5_2: C5.2 R1.2 U0.34 Y1.2
NETC12_2: C12.2 IC2.13
NETC14_2: C14.2 IC2.4
NETC16_2: C16.2 C23.1 R24.1 声音   A3.2
NETC19_2: C19.2 U3.3 触摸按键  29.1
NETC22_1: C22.1 U6.8
NETC22_2: C22.2 U6.1
NETC23_2: C23.2 U6.3
NETC24_1: C24.1 U6.5
NETC24_2: C24.2 DZ1.2 RP2.1
NETCR1_1: CR1.1 D1.1
NETD1_2: D1.2 U5.3
NETE1_1: E1.1 U6.7
NETF1_2: F1.2 电源开关.2
NETIC2_2: IC2.2 RN6.1
NETIC2_3: IC2.3 RN5.1
NETIC2_5: IC2.5 USB.A6 USB.B6
NETIC2_6: IC2.6 USB.A7 USB.B7
NETLCD1602 I2C 0X20_3: LCD1602 I2C 0X20.3 RP1.2
NETLCD1602 I2C 0X20_4: LCD1602 I2C 0X20.4 U1.4
NETLCD1602 I2C 0X20_5: LCD1602 I2C 0X20.5 U1.5
NETLCD1602 I2C 0X20_6: LCD1602 I2C 0X20.6 U1.6
NETLCD1602 I2C 0X20_11: LCD1602 I2C 0X20.11 U1.9
NETLCD1602 I2C 0X20_12: LCD1602 I2C 0X20.12 U1.10
NETLCD1602 I2C 0X20_13: LCD1602 I2C 0X20.13 U1.11
NETLCD1602 I2C 0X20_14: LCD1602 I2C 0X20.14 U1.12
NETLCD1602 I2C 0X20_16: LCD1602 I2C 0X20.16
NETLED1_2: LED1.2 U0.59
NETLED2_2: LED2.2 U0.58
NETLED3_2: LED3.2 U0.57
NETLED4_2: LED4.2 U0.56
NETLED5_2: LED5.2 U0.55
NETLED6_2: LED6.2 U0.54
NETLED7_2: LED7.2 U0.53
NETLED8_2: LED8.2 U0.50
NETLED9_1: LED10.1 R15.2
NETLED10_1: LED9.1 RN1.2
NETQ1_1: R8.2 U1.7
NETR5_1: R5.1
NETR6_1: R6.1
NETR7_1: R7.1
NETR9_2: R9.2 红外发射  9.1
NETR14_1: R14.1 U4.7
NETR18_1: R18.1 S5 26.2
NETR19_2: R19.2 S6 19.2
NETR20_2: R20.2 摇杆 XA5 XA6 Z39.a 摇杆 XA5 XA6 Z39.c
NETTM1_1: TM1.1 数码管  I2C  0X27.12
NETTM1_5: TM1.5 数码管  I2C  0X27.9
NETTM1_6: TM1.6 数码管  I2C  0X27.8
NETTM1_7: TM1.7 数码管  I2C  0X27.6
NETTM1_8: TM1.8 数码管  I2C  0X27.11
NETTM1_9: TM1.9 数码管  I2C  0X27.7
NETTM1_11: TM1.11 数码管  I2C  0X27.4
NETTM1_12: TM1.12 数码管  I2C  0X27.2
NETTM1_13: TM1.13 数码管  I2C  0X27.1
NETTM1_14: TM1.14 数码管  I2C  0X27.10
NETTM1_15: TM1.15 数码管  I2C  0X27.5
NETTM1_16: TM1.16 数码管  I2C  0X27.3
NETU5_1: U5.1 Y3.1
NETU5_2: U5.2 Y3.2
NETUSB_A4-B9: USB.A4-B9 USB.B4-A9 电源开关.3
P1: R10.2 SD卡  SPI   4.2 U0.1
P2: RN6.2 U0.2 串口0.4
P3: RN5.2 U0.3 串口0.3
P5: R5.2 U0.5
P6: U0.6 触摸屏.5 触摸屏.11
P7: U0.7
P12: U0.12 串口2.4
P13: U0.13 串口2.3
P14: R6.2 U0.15
P15: R7.2 U0.16
P18: R9.1 U0.18
P23: R15.1 U0.23
P24: U0.24 人体红外  11.4
P25: R17.1 U0.25 U5.5
P26: R16.1 U0.26 U5.6
P30: C12.1 ICSP.5 REST.1 RR.2 U0.30
P35: U0.35 继电器49.1
P36: U0.36 步进电机.1
P37: U0.37 步进电机.2
P38: U0.38 步进电机.3
P39: U0.39 步进电机.4
P40: U0.40 舵机 44.3
P42: R4.2 U0.42
P45: R23.2 S6 19.1 U0.45 串口1.4
P46: U0.46 串口1.3 红外接收 18.1
P51: U0.51 触摸屏.4
P52: U0.52 触摸屏.3
P63: U0.63 串口3.4
P64: U0.64 串口3.3
P70: R21.1 U0.70 摇杆 XA5 XA6 Z39.b 摇杆 XA5 XA6 Z39.d
P71: U0.71 U3.1
P72: RFID SPI 28.2 U0.72
P74: R22.2 S5 26.1 U0.74
P75: 5.5 S4 25.1 U0.75
P76: 5.6 S3 24.1 U0.76
P77: 5.7 S2 23.2 U0.77
P78: 5.8 S1 22.1 U0.78
P91: U0.91 摇杆 XA5 XA6 Z39.2_VR2
P92: U0.92 摇杆 XA5 XA6 Z39.2_VR1
P93: R2.2 U0.93 光敏.1
P94: RP2.2 U0.94
P95: U0.95 旋钮变阻器  A2.2
P96: U0.96 超声波.3
P97: U0.97 超声波.2
SCK: ICSP.3 JP3.2 R12.1 RFID SPI 28.7 SD卡  SPI   4.5 U0.20
SCL: JP4.3 JP5.3 RN3.2 TM1.2 U0.43 U1.14 U4.14 触摸屏.10
SDA: JP4.4 JP5.4 RN4.2 TM1.3 U0.44 U1.15 U4.13 触摸屏.9
SS: JP3.1 RFID SPI 28.8 U0.19

Pads without a net: CR1 0; IC2 7 8 9 10 11 12 14 15; LCD1602 I2C 0X20 0 7 8 9 10; M1 0; M2 0; M3 0; M4 0; S1 22 3 4; S2 23 3 4; S3 24 3 4; S4 25 3 4; S5 26 3 4; S6 19 3 4; SD卡  SPI   4 0 1 8 9; U0 4 8 9 14 17 27 28 29 41 47 48 49 60 65 66 67 68 69 73 79 82 83 84 85 86 87 88 89 90 98; U1 13; U4 8 9 10; U5 7; USB 1 2 3 4 5 6 A5 A8 B5 B8; 电源开关 1 4 5 6; 触摸屏 0 2 12

## Via types
v1: diameter 0.8, hole 0.4, Top Layer to Bottom Layer, 57 vias
v2: diameter 0.8, hole 0.5, Top Layer to Bottom Layer, 63 vias

## Routing (per net, layer and track width the routed paths; a pad name or vN(x,y) marks a point on that pad's centre or on a via; arc(x,y) is an arc through that point)
GND: length 52
  Top Layer w0.254: C3.1 21.69,74.54 22,74.86 U6.4 ; U4.5 95.84,41.56 95.59,41.81 95.04,41.81 ; C7.2 81.17,42.15 81.17,42.58 80.79,42.96 80.79,43.44 82.02,44.67 U0.32 ; U0.81 88.52,63.96 88.04,64.44 88.04,65.11 C10.2 ; v1(116.16,109.04) 116.17,109.03 116.17,107.56 TM1.4 ; 79.91,65.07 79.91,64.01 79.52,63.62 U0.99 ; 11.21,106.94 CA1.2 ; C8.2 73.11,54.59 73.54,55.01 U0.11 ; C9.2 96.37,54.84 95.05,53.51 U0.62 ; 61.71,108.52 61.71,108.87 ; U4.2 U4.12 U4.11 94.24,42.14 94.56,41.81 95.04,41.81 ; 95.04,41.81 U4.4 ; 5.1 5.2 5.4 131.22,43.26 133.92,40.55 触摸屏.8 ; 21.74,78.06 21.74,78 22.05,77.69 22.46,77.69 22.6,77.54 23.46,77.54 U6.2
  Top Layer w0.61: 9.34,64.86 9.09,65.11 8.11,65.11 USB.B1-A12 ; USB.A1-B12 9.36,71.51 9.76,71.91
  vias: v1(13.91,70.26) v1(16.81,64.94) v1(22.19,17.91) v1(27.11,69.31) v1(48.79,107.98) v1(51.74,104.53) v1(53.51,22.81) v1(55.04,102.12) v1(64.86,109.81) v1(67.39,109.81) v1(67.91,65.16) v1(67.89,63.51) v1(68.46,56.34) v1(70.01,109.84) v1(81.49,43.04) v1(89.51,50.64) v1(93.69,67.51) v1(94.99,61.84) v1(96.51,56.01) v1(99.41,100.29) v1(99.54,103.84) v1(100.09,51.96) v1(104.96,100.14) v1(105.04,103.84) v1(111.01,35.44) v1(111.39,114.54) v1(115.36,35.54) v1(115.39,114.54) v1(151.79,45.44) v1(153.61,45.46) v1(156.96,46.09) v1(160.34,44.56) v1(160.31,42.81)
+3.3: length 516.6
  Top Layer w0.305: 5.49,21.49 5.49,20.29 5.96,19.82 v1(5.96,19.69)
  Top Layer w0.508: 93.46,39.36 93.91,39.36 94.24,39.69 U4.3 ; 93.46,39.36 92.87,39.36 92.64,39.6 U4.1 ; 93.46,39.36 93.44,39.34 v1(93.44,38.26) v1(93.44,37.19) ; 121.31,124.81 121.31,122.02 串口3.1 ; 121.31,124.81 135.76,124.81 ; 121.31,124.81 7.49,124.81 1.01,118.34 1.01,93.34 2.52,91.83 5.03,91.83 ; 135.76,124.81 135.76,122.07 串口2.1 ; 135.76,124.81 167.36,124.81 173.54,118.64 173.54,87.14 170.52,84.12 RFID SPI 28.1 ; U4.6 96.64,39.29 95.66,38.31 R14.2 v1(93.44,37.19) ; v1(93.44,37.19) C17.1 ; R12.2 R11.2 12.05,19.92 12.41,19.56 SD卡  SPI   4.4 12.41,15.74 12.79,15.36 17.21,15.36 18.3,16.45 18.3,18.45 20.16,20.31 C18.2
  Top Layer w0.61: 5.03,103.32 5.03,91.83 1.54,88.34 1.54,49.84 3.56,47.81 33.39,47.81 33.39,52.58 IC3.2 ; R10.1 C18.2 ; C13.2 34.95,47.79 35.31,47.43 35.31,36.46 36.89,34.89 v2(52.29,34.89) ; 5.49,21.49 5.63,21.62
  Bottom Layer w0.305: v1(5.96,19.69) 18.53,19.69 18.95,19.26 v1(19.09,19.26)
  Bottom Layer w0.61: v1(93.44,38.26) 93.44,31.26 92.41,30.24 56.94,30.24 v2(52.29,34.89) v1(50.86,34.89) ; 28.29,47.76 v1(28.3,47.77) 29.55,47.77 v1(29.59,47.81) 29.59,23.96 24.89,19.26 v1(19.09,19.26) 18.36,18.54
  vias: v1(18.21,18.36)
+5: length 1127.9
  Top Layer w0.254: C8.1 72.79,56.49 73.76,55.51 U0.10 ; F1.1 17.94,59.59 17.94,66.04 17.59,66.39 RN1.1 ; v1(86.46,40.49) 86.46,40.56 86.41,40.61 86.44,40.61 86.58,40.48 86.59,40.49 87.51,40.49 RN3.1 RN4.1 ; U0.100 79.02,63.45 78.01,64.45 C6.1 ; 131.06,95.26 131.09,95.29 ; R17.2 101.06,75.06 101.69,74.44 101.69,68.31 101.28,67.91 U5.8 100.11,67.86 C20.1 ; R4.1 24.41,83.46 23.15,82.2 20.51,82.2 ; 3.5 1.5 1.6 1.7 1.8
  Top Layer w0.305: 95.61,67.96 95.67,67.91 U5.8 ; 95.61,67.96 95.61,70.06 R16.2 ; 95.61,67.96 95.61,66.51 94.36,65.26 89.79,65.26 89.69,65.16 89.69,64.54 89.02,63.87 U0.80 89.02,60.43 90.51,58.94 90.51,57.79 89.75,57.02 89.72,57.02 ; v2(153.96,49.61) 153.99,49.64 153.99,49.66 155.16,50.84 2.4 2.3 2.2 2.1 ; v1(20.49,70.09) 19.74,70.84 19.74,74.17 19.79,74.22 ; RP1.1 33.61,116.09 34.71,117.19 R8.1 37.16,119.84 36.62,120.38 JP4.1 ; 96.37,52.94 C9.1
  Top Layer w0.355: 79.89,55.51 79.75,55.65 79.75,57.81 ; 79.89,55.51 81.5,53.9 81.5,46.26 ; 79.89,55.51 U0.10 ; 79.75,57.81 79.85,57.71 89.04,57.71 89.72,57.02 89.72,53.65 90.36,53.01 U0.61 92.77,53.01 96.3,53.01 96.37,52.94 ; 79.75,57.81 79.75,58.39 79.02,59.12 U0.100 ; U0.31 81.52,44.87 79.59,42.94 C7.1
  Top Layer w0.406: C2.2 14.04,49.96 14.24,49.76 ; 68.53,18.14 70.74,18.14 ; 70.74,18.14 100.19,18.14 3.5 ; 70.74,18.14 1.8 ; 157.48,16.08 158.64,16.08 159.26,16.7 159.26,18.31 156.96,20.61 R19.1 150.29,20.66 150.29,23.69 146.76,27.21 v1(144.96,27.21) ; v1(20.49,70.09) 20.44,70.04 20.44,68.39 21.09,67.74 29.91,67.74 30.79,68.61 30.79,69.84 C15.1 31.07,70.13 31.07,70.78 32.14,71.84 33.49,71.84 35.29,73.63 35.29,75.39 34.55,76.13 U6.6 ; 18.23,74.52 C3.2 ; R24.2 18.41,74.49 18.41,72.41 R2.1 ; R20.1 40.24,29.19 v2(41.79,29.19) ; v1(35.74,66.44) 35.63,66.44 35.15,65.96 IC2.16 ; v2(42.69,17.64) 42.61,17.56 R18.2 ; C21.2 131.06,95.26
  Top Layer w0.61: TM1.10 112.34,102.17 112.34,99.41 114.24,97.51 120.49,97.51 122.71,95.29 v1(128.81,95.29) v1(129.99,95.29) 152.74,95.29 155.09,97.64 155.09,105.94 157.74,108.59 165.39,108.59 165.99,109.19 165.99,115.29 164.82,116.45 串口0.1 168.09,122.01 171.58,118.52 ICSP.2 ; 31.21,54.09 31.09,54.21 RR.1 ; 85.07,108.9 LCD1602 I2C 0X20.15
  Top Layer w0.813: CA1.1 11.21,113.73 11.12,113.82 JP1.2 ; IC3.3 34.91,49.75 34.99,49.84 36.48,49.84 37.35,50.71 触摸屏.6 ; C7.1 77.61,41.84 72.59,36.81 72.59,28.06 v1(73.41,27.24) v1(74.56,27.24)
  Top Layer w1.016: 触摸屏.6 37.51,53.96 36.14,55.34 31.89,55.34 31.21,54.66 31.21,52.53 28.44,49.76 13.11,49.76 11.64,51.24 11.64,54.79 12.91,56.06 15.16,56.06 17.41,58.31 F1.1
  Bottom Layer w0.254: v1(86.46,40.49) 84.96,38.99 v1(74.74,38.99)
  Bottom Layer w0.305: 141.96,49.44 142.14,49.61 v2(153.96,49.61)
  Bottom Layer w0.406: 8.51,91.31 10.46,91.31 12.54,93.39 12.54,99.19 16.19,102.84 20.11,102.84 ; 31.16,49.26 17.69,49.26 16.76,48.34 摇杆 XA5 XA6 Z39.1_VR1 16.76,42.46 12.74,38.44 4.59,38.44 摇杆 XA5 XA6 Z39.1_VR2 ; v2(42.69,17.64) 42.69,28.86 42.38,29.17 41.81,29.17 v2(41.79,29.19) ; v2(68.06,18.11) 67.99,18.19 66.34,18.19 65.66,17.51 42.64,17.51
  Bottom Layer w0.61: 141.96,83.79 143.31,83.79 旋钮变阻器  A2.3 ; 141.96,83.79 141.96,77.99 ; 141.96,83.79 133.7,92.05 ; LCD1602 I2C 0X20.15 83.07,113.51 52.73,113.51 52.05,114.19 LCD1602 I2C 0X20.2 ; 触摸屏.7 137.36,38.01 141.96,42.61 141.96,77.99 ; 141.96,77.99 167.45,77.99 红外接收 18.3 ; 129.96,88.16 129.99,88.13 133.7,91.84 133.7,92.05 ; 133.7,92.05 130.46,95.29 v1(129.99,95.29) v1(128.81,95.29)
  Bottom Layer w0.813: 60.49,125.81 69.99,125.81 ; 60.49,125.81 60.51,125.79 舵机 44.2 ; 60.49,125.81 51.14,125.81 ; 69.99,125.81 80.19,125.81 ; 69.99,125.81 70.01,125.79 步进电机.5 ; 101.51,125.81 101.51,121.96 继电器49.3 ; 101.51,125.81 150.41,125.81 ; 101.51,125.81 86.81,125.81 ; 150.41,125.81 164.24,125.81 164.84,125.21 164.84,122.03 串口0.1 ; 150.41,125.81 150.32,125.72 串口1.1 ; v1(144.96,27.21) 33.06,27.21 31.54,28.74 31.54,49.31 32.94,50.71 触摸屏.6 37.51,65.31 36.39,66.44 v1(35.74,66.44) ; 80.19,125.81 80.17,125.8 ; 80.19,125.81 86.81,125.81 ; JP3.6 9.51,120.19 5.09,115.76 5.09,106.26 JP1.8 8.51,102.72 8.51,84.14 10.51,82.14 20.21,82.14 ; 36.66,125.81 51.14,125.81 ; 36.66,125.81 36.66,122.05 JP4.1 ; 36.66,125.81 10.86,125.81 9.49,124.44 9.49,122.23 ; 51.14,125.81 51.14,122.02 JP5.1 51.13,118.19 52.22,117.1 52.22,115.68 LCD1602 I2C 0X20.2 ; 超声波.4 86.81,122.1 86.81,125.81 ; 35.74,66.46 24.11,66.46 v1(20.49,70.09) 20.49,76.05 20.51,76.08 20.51,82.14
MISO: length 162.4
  Top Layer w0.254: 35.66,107.71 29.66,107.71 27.04,110.34 27.04,113.49 25.36,115.16 17.79,115.16 14.59,118.36 JP3.4 ; 9.04,14.46 5.09,14.46 3.59,15.96 R13.1 ; 9.04,14.46 9.11,14.54 SD卡  SPI   4.7 ; 9.04,14.46 20.76,14.46 26.96,20.66 45.16,20.66 v1(73.16,48.66) 74.01,49.51 U0.22 ; 163.49,90.09 167.68,94.28 RFID SPI 28.5
  Bottom Layer w0.254: ICSP.1 170.29,113.84 172.71,113.84 173.96,112.59 173.96,97.81 170.43,94.28 RFID SPI 28.5
MOSI: length 140.3
  Top Layer w0.254: JP3.3 17.13,118.24 19.46,115.91 25.66,115.91 27.76,113.81 27.76,110.69 30.14,108.31 36.01,108.31 ; SD卡  SPI   4.3 13.51,19.81 13.95,20.25 R11.1 13.95,23.18 14.99,24.21 25.54,24.21 27.86,21.89 43.89,21.89 68.42,46.42 69.09,46.42 v1(72.19,49.51) 72.69,50.01 U0.21 ; RFID SPI 28.6 167.45,96.82 161.39,90.76
  Bottom Layer w0.254: ICSP.4 173.11,111.01 173.11,99.29 170.65,96.82 RFID SPI 28.6
NET1_1: length 13.8
  Top Layer w0.254: 1.1 70.76,14.69 63.04,6.96 LED1.1
NET1_2: length 12
  Top Layer w0.254: 1.2 71.64,8.02 70.59,6.96 LED2.1
NET1_3: length 11.8
  Top Layer w0.254: 1.3 72.44,8.06 73.54,6.96 LED3.1
NET1_4: length 14
  Top Layer w0.254: LED4.1 81.86,7.04 80.51,7.04 73.32,14.23 1.4
NET2_5: length 12.7
  Top Layer w0.254: S4 25.2 155.31,47.84 156.76,49.29 2.5
NET2_6: length 28.9
  Top Layer w0.254: 2.6 157.81,52.54 158.81,51.54 158.81,44.96 157.29,43.44 157.29,38.51 156.21,37.44 149.96,37.44 149.01,38.39 S3 24.2
NET2_7: length 18.6
  Top Layer w0.254: 2.7 163.04,53.34 165.51,50.86 S2 23.1
NET2_8: length 6.2
  Top Layer w0.254: S1 22.2 160.31,56.21 158.32,54.22 2.8
NET3_1: length 13.8
  Top Layer w0.254: LED5.1 88.68,7.06 89.51,7.06 97.66,15.21 3.1
NET3_2: length 11.9
  Top Layer w0.254: LED6.1 96.81,6.96 98.54,8.69 3.2
NET3_3: length 11.1
  Top Layer w0.254: 99.34,16.56 99.34,8.79 100.96,7.16 101.67,7.16 LED7.1
NET3_4: length 13
  Top Layer w0.254: LED8.1 100.22,15.26 3.4
NETC4_2: length 19.8
  Top Layer w0.254: 80.29,37.21 80.29,39.01 82.52,41.24 U0.33 ; 80.29,37.21 84.39,37.21 R1.1 ; 80.29,37.21 80.29,34.96 Y1.1
NETC5_2: length 19.5
  Top Layer w0.254: R1.2 86.31,33.74 Y1.2 ; R1.2 86.24,37.25 86.24,38.05 83.02,41.28 U0.34 ; R1.2 90.09,37.19 90.19,37.29
NETC12_2: length 3
  Top Layer w0.254: IC2.13 35.17,62.15
NETC14_2: length 6.7
  Top Layer w0.254: IC2.4 22,62.15 21.39,62.76 C14.2
NETC16_2: length 22.8
  Top Layer w0.254: R24.1 16.54,75.41 17.49,76.36 C23.1 19.84,76.31 ; 声音   A3.2 30.68,86.7 30.68,84.6 28.74,82.66 24.64,82.66 23.48,81.51 21.9,81.51 19.89,79.49 19.89,76.36
NETC19_2: length 15.8
  Top Layer w0.254: U3.3 155.33,12.36 155.34,12.36 155.34,10.74 156.76,9.31 163.96,9.31 触摸按键  29.1
NETC22_1: length 3.7
  Top Layer w0.254: U6.8 29.26,80.34 28.59,81.01 27.56,81.01 C22.1
NETC22_2: length 3.5
  Top Layer w0.254: U6.1 23.61,79.56 24.92,80.87 25.42,80.87 C22.2
NETC23_2: length 1.9
  Top Layer w0.254: U6.3 23.11,76.13 22.88,76.36 21.79,76.36
NETC24_1: length 2
  Top Layer w0.254: C24.1 29.26,73.04 U6.5
NETC24_2: length 13.1
  Top Layer w0.254: 33.51,74.21 33.39,74.21 32.09,72.91 C24.2 31.04,72.72 30.72,72.4 30.53,72.4 29.94,71.81 28.14,71.81 27.24,70.91 24.06,70.91 23.21,70.06 RP2.1
NETCR1_1: length 18.5
  Top Layer w0.61: CR1.1 109.26,55.11 104.69,59.69 D1.1
NETD1_2: length 7.8
  Top Layer w0.61: D1.2 104.43,65.57 102.61,67.39 102.61,69.96 103.1,70.45 U5.3
NETE1_1: length 7.5
  Top Layer w0.254: 33.76,81.26 E1.1
  Top Layer w0.406: E1.1 32.59,81.36 31.61,80.39 31.61,78.29 30.72,77.4 U6.7
NETF1_2: length 6.3
  Top Layer w1.016: 电源开关.2 8.6,55.6 9.88,55.6 12.09,57.82 12.42,57.82 12.91,58.31 F1.2
NETIC2_2: length 8.6
  Top Layer w0.254: IC2.2 28.76,64.69 32.78,68.7 32.97,68.7 33.29,69.02 33.29,69.21
NETIC2_3: length 3.5
  Top Layer w0.254: IC2.3 24.07,63.42 23.55,63.94 RN5.1
NETIC2_5: length 29.4
  Top Layer w0.254: USB.B6 9.49,67.56 9.94,67.11 v2(9.94,67.04) ; 9.96,68.56 17.99,68.56 19.69,66.86 19.69,63.04 21.85,60.88 IC2.5 ; 9.96,68.56 USB.A6 ; 9.96,68.56 9.96,69.41 v2(9.94,69.44)
  Bottom Layer w0.254: v2(9.94,67.04) v2(9.94,69.44)
NETIC2_6: length 27.4
  Top Layer w0.254: IC2.6 22.19,59.61 19.01,62.79 19.01,66.76 17.71,68.06 USB.A7 7.19,68.06 6.99,68.26 6.99,68.86 7.19,69.06 USB.B7
NETLCD1602 I2C 0X20_3: length 19.3
  Top Layer w0.254: LCD1602 I2C 0X20.3 54.59,113.92 53.79,113.11 RP1.2
NETLCD1602 I2C 0X20_4: length 10
  Top Layer w0.254: LCD1602 I2C 0X20.4 55.89,114.27 55.89,105.99
NETLCD1602 I2C 0X20_5: length 10.3
  Top Layer w0.254: LCD1602 I2C 0X20.5 57.04,112.88 57.04,106.34
NETLCD1602 I2C 0X20_6: length 5.5
  Top Layer w0.254: 58.31,111.61 LCD1602 I2C 0X20.6
NETLCD1602 I2C 0X20_11: length 1.1
  Top Layer w0.254: 75.44,114.64 74.91,115.16 LCD1602 I2C 0X20.11
NETLCD1602 I2C 0X20_14: length 6.6
  Top Layer w0.254: 82.53,108.88 LCD1602 I2C 0X20.14
NETLCD1602 I2C 0X20_16: length 34.2
  Top Layer w0.254: LCD1602 I2C 0X20.16 87.61,117.11 87.19,117.54 74.09,117.54 73.64,117.09 73.64,112.06 72.73,111.15 60.76,111.15
NETLED1_2: length 83.2
  Top Layer w0.254: U0.59 96.69,52.01 103.16,45.54 103.16,29.99 93.41,20.24 65.06,20.24 62.01,17.19 LED1.2
NETLED2_2: length 98.7
  Top Layer w0.254: LED2.2 67.51,9.06 66.96,8.51 66.96,6.16 65.61,4.81 60.84,4.81 59.81,5.84 59.81,15.84 64.76,20.79 93.16,20.79 102.64,30.26 102.64,45.34 96.46,51.51 U0.58
NETLED3_2: length 109.7
  Top Layer w0.254: LED3.2 76.36,9.06 76.99,8.44 76.99,5 76.25,4.26 60.56,4.26 59.26,5.56 59.26,16.16 64.49,21.39 92.94,21.39 102.14,30.59 102.14,45.09 96.21,51.01 U0.57
NETLED4_2: length 118.7
  Top Layer w0.254: U0.56 95.96,50.51 101.64,44.84 101.64,30.84 92.81,22.01 64.26,22.01 58.66,16.41 58.66,5.29 60.24,3.71 83.59,3.71 84.71,4.84 84.71,7.71 83.36,9.06 LED4.2
NETLED5_2: length 120
  Top Layer w0.254: LED5.2 87.34,9.06 85.99,7.71 85.99,5.19 83.91,3.11 59.89,3.11 58.01,4.99 58.01,16.61 63.99,22.59 92.56,22.59 101.06,31.09 101.06,44.56 95.61,50.01 U0.55
NETLED6_2: length 125.8
  Top Layer w0.254: LED6.2 93.94,9.06 87.36,2.49 59.51,2.49 57.29,4.71 57.29,16.71 63.74,23.16 92.36,23.16 100.51,31.31 100.51,44.36 95.36,49.51 U0.54
NETLED7_2: length 139
  Top Layer w0.254: U0.53 94.96,49.01 99.94,44.04 99.94,31.56 92.06,23.69 63.54,23.69 56.59,16.74 56.59,4.51 59.21,1.89 102.14,1.89 103.26,3.01 103.26,8.76 102.87,9.16 101.96,9.16 LED7.2
NETLED8_2: length 149.7
  Top Layer w0.254: U0.50 91.03,46.24 91.03,45.09 91.24,44.89 98.24,44.89 99.41,43.71 99.41,31.89 91.81,24.29 63.41,24.29 55.94,16.81 55.94,4.29 58.94,1.29 110.11,1.29 110.96,2.14 110.96,8.24 110.14,9.06 LED8.2
NETLED9_1: length 5.7
  Top Layer w0.254: 159.14,104.02 159.14,102.73 160.54,101.34 R15.2
NETLED10_1: length 2.6
  Top Layer w0.254: RN1.2 13.59,63.84 13.62,63.81
NETQ1_1: length 36.4
  Top Layer w0.254: 59.81,108.87 59.81,111.89 60.46,112.54 62.89,112.54 63.44,113.09 63.44,117.21 62.66,117.99 39.86,117.99 39.49,117.62 39.3,117.62 39.06,117.38 R8.2
NETR5_1: length 12.6
  Top Layer w0.254: R5.1 17.66,102.36 18.76,101.26 19.79,101.26 20.11,101.59
NETR6_1: length 11.7
  Top Layer w0.254: R6.1 22.34,108.61 20.76,107.04 19.04,107.04 18.59,106.59 18.59,104.49 18.79,104.29 19.91,104.29 20.11,104.09
NETR7_1: length 14.3
  Top Layer w0.254: 20.11,105.34 20.54,105.76 21.71,105.76 21.71,98.2 25.09,94.83 R7.1
NETR9_2: length 9.3
  Top Layer w0.254: R9.2 169.51,67.34 166.59,64.41 166.59,62.31 167.18,61.72 红外发射  9.1
NETR14_1: length 5.4
  Top Layer w0.254: R14.1 97.61,37.24 97.61,41.59 97.44,41.75 96.79,41.75 U4.7
NETR18_1: length 13.4
  Top Layer w0.254: R18.1 36.24,17.56 35.24,18.56 28.31,18.56 S5 26.2
NETR19_2: length 6.4
  Top Layer w0.254: S6 19.2 146.94,20.61 R19.2 148.56,20.49
NETR20_2: length 24.3
  Top Layer w0.254: R20.2 24.79,29.26 22.51,31.54 摇杆 XA5 XA6 Z39.a 摇杆 XA5 XA6 Z39.c
NETTM1_1: length 12.9
  Top Layer w0.254: 数码管  I2C  0X27.12 129.32,107.51 120.02,107.51 TM1.1
NETTM1_5: length 28.3
  Top Layer w0.254: 数码管  I2C  0X27.9 139.2,109.77 139.2,108.78 136.06,105.64 115.79,105.64 114.91,106.51 114.91,107.54 TM1.5
NETTM1_6: length 34.5
  Top Layer w0.254: 数码管  I2C  0X27.8 142.14,109.86 142.14,107.04 140.09,104.99 114.46,104.99 113.63,105.82 TM1.6
NETTM1_7: length 38.4
  Top Layer w0.254: 数码管  I2C  0X27.6 144.71,100.04 144.71,102.16 142.46,104.41 113.14,104.41 112.36,105.19 TM1.7
NETTM1_8: length 26.9
  Top Layer w0.254: TM1.8 111.09,109.44 111.59,109.94 125.49,109.94 127.39,111.84 132.54,111.84 数码管  I2C  0X27.11
NETTM1_9: length 46.9
  Top Layer w0.254: TM1.9 110.03,102.19 109.34,102.89 109.34,109.84 110.41,110.91 124.8,110.91 127.1,113.21 141.32,113.21 数码管  I2C  0X27.7
NETTM1_11: length 30.3
  Top Layer w0.254: TM1.11 113.63,100.34 115.32,98.65 120.85,98.65 121.79,97.71 138.36,97.71 139.27,98.62 139.27,99.68 数码管  I2C  0X27.4
NETTM1_12: length 22.8
  Top Layer w0.254: TM1.12 114.9,100.17 115.84,99.23 121.7,99.23 122.54,98.39 132.9,98.39 数码管  I2C  0X27.2
NETTM1_13: length 17.6
  Top Layer w0.254: TM1.13 116.17,100.5 116.82,99.85 数码管  I2C  0X27.1
NETTM1_14: length 43
  Top Layer w0.254: 数码管  I2C  0X27.10 134.5,112.41 127.04,112.41 125.06,110.44 110.89,110.44 110.01,109.56 110.01,105.01 111.11,103.91 117.01,103.91 117.44,103.48 TM1.14
NETTM1_15: length 27.4
  Top Layer w0.254: TM1.15 118.71,103.44 119.14,103.86 139.74,103.86 141.98,101.62 数码管  I2C  0X27.5
NETTM1_16: length 18.7
  Top Layer w0.305: TM1.16 135.88,102.19 136.9,101.17 数码管  I2C  0X27.3
NETU5_1: length 7
  Top Layer w0.254: Y3.1 109.31,66.26 108.06,66.26 106.42,67.91 U5.1
NETU5_2: length 5
  Top Layer w0.254: U5.2 107.72,69.18 108.48,68.42 108.48,67.64 Y3.2
NETUSB_A4-B9: length 28.2
  Top Layer w0.61: USB.A4-B9 10.61,70.71 v2(10.66,70.76) ; 电源开关.3 8.51,59.01 10.29,60.79 10.29,65.16 9.54,65.91 USB.B4-A9
  Bottom Layer w0.61: 电源开关.3 8.51,59.01 11.39,61.89 11.39,69.98 10.66,70.71 v2(10.66,70.76)
P1: length 96.6
  Top Layer w0.254: U0.1 69.25,60.01 v2(67.8,61.46) ; SD卡  SPI   4.2 14.61,19.64 14.86,19.89 15.68,19.89 16.28,20.49 R10.2 16.28,22.56 16.94,23.21 22.34,23.21 24.26,21.29 44.54,21.29 68.14,44.89 v2(68.14,44.94)
  Bottom Layer w0.254: v2(68.14,44.94) 68.14,48.51 67.21,49.44 67.21,60.88 v2(67.8,61.46)
P2: length 125.9
  Top Layer w0.254: v2(59.26,69.29) 59.26,68.66 68.79,59.14 72.99,59.14 73.36,59.51 U0.2 ; v2(53.46,69.26) 52.16,69.26 51.46,69.96 38.94,69.96 38.04,69.06 35.34,69.06 RN6.2 ; 串口0.4 157.2,120.03 152.14,114.96 126.46,114.96 124.01,112.51 94.41,112.51
  Bottom Layer w0.254: v2(53.46,69.26) 53.47,69.27 59.25,69.27 v2(59.26,69.29) 60.54,69.29 61.36,70.11 67.26,70.11 68.79,71.64
P3: length 143.7
  Top Layer w0.254: 串口0.3 159.74,120.37 153.71,114.34 126.76,114.34 124.41,111.99 94.71,111.99 ; U0.3 73.76,59.01 73.34,58.59 68.46,58.59 58.26,68.79 58.26,70.76 v2(58.21,70.81) ; v2(52.39,70.84) 51.91,70.36 32.26,70.36 31.91,70.01 31.91,68.64 30.34,67.06 26.01,67.06 24.79,65.84 RN5.2
  Bottom Layer w0.254: v2(52.39,70.84) 52.4,70.82 58.2,70.82 v2(58.21,70.81) 66.99,70.81 68.14,71.96
P5: length 67.2
  Top Layer w0.254: R5.2 19.56,113.26 20.01,113.71 24.74,113.71 25.41,113.04 25.41,103.99 27.36,102.04 34.46,102.04 43.86,92.64 46.94,92.64 ; 57.44,68.61 68.04,58.01 U0.5
P6: length 114.5
  Top Layer w0.254: 触摸屏.5 67.67,48.17 70.91,51.41 v2(74.54,51.41) ; U0.6 74.91,57.51 74.56,57.16 v2(74.54,57.16)
  Bottom Layer w0.254: 触摸屏.11 86.32,48.17 83.24,45.09 76.29,45.09 74.54,46.84 v2(74.54,51.41) v2(74.54,57.16)
P7: length 42.4
  Top Layer w0.254: 46.64,91.91 42.04,91.91 34.53,99.42 33.4,99.42 33.16,99.66 ; U0.7 75.71,57.01 74.99,56.29 74.06,56.29 72.91,57.44 67.66,57.44 56.81,68.29
P12: length 54.7
  Top Layer w0.254: 串口2.4 128.13,121.94 128.13,120.93 127.36,120.16 93.04,120.16 89.39,116.51 89.39,111.24 ; v2(79.41,54.54) 79.4,54.52 77.28,54.52 U0.12
  Bottom Layer w0.254: v2(79.41,54.54) 79.49,54.62 80.19,54.62 83.59,58.01
P13: length 58.2
  Top Layer w0.254: 89.89,110.81 89.89,116.11 93.34,119.56 128.29,119.56 串口2.3 ; U0.13 77.28,53.99 78.45,53.99 v2(79.41,53.04)
  Bottom Layer w0.254: 84.19,57.56 81.61,54.99 81.61,54.24 80.41,53.04 v2(79.41,53.04)
P14: length 63
  Top Layer w0.254: 56.24,66.99 67.98,55.24 68.68,55.24 70.41,53.51 75.36,53.51 75.86,53.01 U0.15 ; 24.24,111.96 24.26,111.93 24.26,102.78 35.96,91.09 46.39,91.09
P15: length 48.6
  Top Layer w0.254: U0.16 75.46,52.51 74.96,53.01 70.19,53.01 68.66,54.54 67.89,54.54 55.61,66.81 ; R7.2 31.54,94.64 35.86,90.31 46.21,90.31
P18: length 99.6
  Top Layer w0.254: v2(79.44,51.36) 79.29,51.36 79.14,51.51 U0.18 ; v2(127.76,52.76) 135.21,60.21 158.79,60.21 166.81,68.24 R9.1
  Bottom Layer w0.254: v2(127.76,52.76) 123.69,48.69 82.11,48.69 v2(79.44,51.36)
P23: length 12.4
  Top Layer w0.254: 154.11,92.74 158.64,97.26 158.64,98.84 ; 158.64,98.84 158.89,99.09 ; 158.64,98.84 R15.1 ; v2(79.51,49.41) 79.51,49.34 79.19,49.01 U0.23
  Bottom Layer w0.254: 78.41,50.51 v2(79.51,49.41)
P24: length 8.7
  Top Layer w0.254: 125.14,89.39 129.99,84.54 ; U0.24 75.66,48.51 75.56,48.41 v2(75.44,48.41)
P25: length 54
  Top Layer w0.254: 98.19,73.19 99.19,73.19 100.06,72.31 U5.5 ; 98.19,73.19 77.39,73.19 76.87,72.66 v2(76.81,72.66) ; 98.19,73.19 98.16,73.21 R17.1 ; v2(76.31,46.99) 76.34,47.01 76.84,47.01 77.09,47.26 77.09,47.97 77.13,48.01 U0.25
  Bottom Layer w0.254: v2(76.81,72.66) 76.81,72.56 76.31,72.06 v2(76.31,46.99)
P26: length 50.2
  Top Layer w0.254: v2(77.74,46.21) 77.86,46.21 77.91,46.26 U0.26 ; U5.6 98.78,70.45 97.24,71.99 78.06,71.99 v2(77.46,71.39)
  Bottom Layer w0.254: v2(77.46,71.39) 77.36,71.28 77.36,48.39 77.74,48.01 v2(77.74,46.21)
P30: length 148.9
  Top Layer w0.254: 95.16,111.46 124.66,111.46 127.01,113.81 v2(163.56,113.81) ; v2(74.11,45.76) 76.16,43.71 79.66,43.71 81,45.05 81,46.24 U0.30 ; v2(69.24,51.21) 59.69,60.76 35.56,60.76 35.56,57.96 33.89,56.29 28.14,56.29 27.59,55.74 RR.2 24.81,54.21
  Bottom Layer w0.254: ICSP.5 167.37,110 v2(163.56,113.81) ; v2(74.11,45.76) 74.06,45.81 73.56,45.81 69.24,50.14 v2(69.24,51.21) 69.29,51.21 70.34,52.26
P35: length 18.7
  Top Layer w0.254: v2(88.79,55.46) 84.51,55.46 82.51,53.46 82.51,49.64 83.52,48.63 U0.35
  Bottom Layer w0.254: 106.55,120.33 继电器49.1 ; v2(88.79,55.46) 90.46,57.14
P36: length 32.2
  Top Layer w0.305: v2(83.39,52.11) 83.39,49.76 84.02,49.13 U0.36
  Bottom Layer w0.305: 85.74,57.39 83.39,55.04 v2(83.39,52.11) ; 90.26,110.09 90.26,116.36 88.14,118.49 81.94,118.49 80.11,120.31 80.11,121.84 79.94,122.01
P37: length 37.6
  Top Layer w0.305: v2(84.49,51.29) 84.51,51.26 84.51,46.27 U0.37
  Bottom Layer w0.254: 88.61,119.14 83.44,119.14 81.79,120.79 81.79,123.06 81.31,123.54 78.11,123.54 77.63,123.06 步进电机.2
  Bottom Layer w0.305: 90.91,109.61 90.91,116.84 88.61,119.14 ; 86.51,57.19 84.49,55.16 84.49,51.3
P38: length 38.2
  Top Layer w0.305: v2(85.91,51.24) 85.02,50.34 U0.38
  Bottom Layer w0.254: 88.71,120.11 83.56,120.11 82.69,120.99 82.69,124.16 75.64,124.16 75.09,123.62 步进电机.3
  Bottom Layer w0.305: 88.71,120.11 91.64,117.19 91.64,109.31 ; v2(85.91,51.24) 85.99,51.24 87.26,52.51
P39: length 42.1
  Top Layer w0.305: U0.39 85.52,49.41 87.24,51.14 v2(87.31,51.14)
  Bottom Layer w0.254: 步进电机.4 72.55,123.58 73.81,124.84 83.46,124.84 83.46,121.46 84.19,120.74 89.24,120.74 89.51,120.46
  Bottom Layer w0.305: 92.41,109.09 92.41,117.56 89.51,120.46 ; v2(87.31,51.14) 88.06,51.89
P40: length 57.3
  Top Layer w0.305: v2(87.09,49.61) 86.02,48.54 U0.40
  Bottom Layer w0.305: 84.89,57.49 82.41,55.01 82.41,51.56 84.36,49.61 v2(87.09,49.61) ; 89.54,110.49 89.54,116.04 88.19,117.39 59.84,117.39 57.97,119.25 舵机 44.3
P42: length 97.9
  Top Layer w0.254: U0.42 87,46.24 87,44.95 86.21,44.16 v2(84.01,44.16) ; R4.2 26.31,85.71 ; 26.31,85.71 26.31,86.59 27.81,88.09 35.01,88.09 39.05,84.05 39.05,82.12 43.89,77.29 53.09,77.29 54.56,75.81 54.56,67.1 v2(68.18,53.49) ; 26.31,85.71 26.29,85.74 23.14,85.74 22.14,84.74 20.51,84.74
  Bottom Layer w0.254: v2(68.18,53.49) 68.18,49.94 73.96,44.16 v2(84.01,44.16)
P45: length 236.5
  Top Layer w0.254: S6 19.1 148.56,12.26 143.46,7.16 141.24,7.16 138.81,4.74 136.54,4.74 ; v2(88.79,44.44) 88.79,44.58 88.52,44.85 U0.45
  Bottom Layer w0.254: S6 19.1 148.56,34.84 ; 148.56,34.84 168.74,34.84 173.51,39.61 173.51,56.66 171.96,58.21 171.96,79.56 170.16,81.36 167.19,81.36 165.89,82.66 165.89,109.81 156.04,119.66 143.34,119.66 142.7,120.3 串口1.4 ; 148.56,34.84 132.79,34.84 128.04,39.59 90.56,39.59 88.79,41.36 v2(88.79,44.44)
P46: length 209.4
  Top Layer w0.254: U0.46 89.03,46.24 89.03,45.24 v2(89.94,44.34)
  Bottom Layer w0.254: 红外接收 18.1 171.3,72.97 171.36,72.91 ; 串口1.3 145.24,123.43 144.59,124.09 141.54,124.09 140.76,123.31 140.76,120.31 142.19,118.89 155.51,118.89 165.11,109.29 165.11,82.64 166.94,80.81 169.91,80.81 171.36,79.36 171.36,72.91 ; v2(89.94,44.34) 89.94,44.31 89.54,43.91 89.54,41.54 90.99,40.09 128.26,40.09 132.86,35.49 168.31,35.49 172.76,39.94 172.76,56.26 171.36,57.66 171.36,72.91
P51: length 65.9
  Top Layer w0.254: v2(94.34,46.46) 94.34,47.74 94.06,48.01 U0.51
  Bottom Layer w0.254: v2(94.34,46.46) 93.74,45.86 86.36,45.86 85.04,44.54 85.04,41.64 84.06,40.66 45.11,40.66 40.14,45.63 触摸屏.4
P52: length 68
  Top Layer w0.254: U0.52 94.39,48.51 95.81,47.09 v2(95.81,46.49)
  Bottom Layer w0.254: v2(95.81,46.49) 94.66,45.34 87.06,45.34 85.94,44.21 85.94,41.54 84.44,40.04 44.69,40.04 41.63,43.09 触摸屏.3
P63: length 18.5
  Top Layer w0.254: v2(90.66,53.96) 90.69,53.99 92.75,53.99 U0.63
  Bottom Layer w0.254: 串口3.4 113.7,119.68 111.01,116.99 104.14,116.99 ; 91.09,56.66 90.14,55.71 90.14,54.63 90.66,54.11 v2(90.66,53.96)
P64: length 18.7
  Top Layer w0.254: U0.64 92.75,54.53 91.69,54.53 v2(91.06,55.16)
  Bottom Layer w0.254: 串口3.3 116.24,119.84 112.74,116.34 104.46,116.34 ; 91.66,56.26 91.11,55.71 91.11,55.21 v2(91.06,55.16)
P70: length 206.5
  Top Layer w0.254: U0.70 97.46,57.51 103.84,51.14 103.84,29.34 v2(103.21,28.71) ; 38.29,31.41 33.05,31.41 32.17,32.29 27.56,32.29 摇杆 XA5 XA6 Z39.b 摇杆 XA5 XA6 Z39.d 27.01,41.09 26.46,41.64 21.76,41.64 16.16,36.04 16.16,32.81 7.46,24.11 3.46,24.11 2.29,22.94 2.29,16.04 4.74,13.59 21.56,13.59 23.26,15.29 23.26,15.76 26.61,19.11 56.44,19.11 62.81,25.49 90.31,25.49 v2(93.49,28.66)
  Bottom Layer w0.254: v2(93.49,28.66) 93.51,28.69 103.19,28.69 v2(103.21,28.71)
P71: length 97.7
  Top Layer w0.254: U0.71 97.74,58.01 104.41,51.34 104.41,26.31 112.04,18.69 137.16,18.69 140.54,15.31 144.74,15.31 145.76,16.34 145.76,17.24 147.46,18.94 152.97,18.94 154.88,17.03 U3.1
P72: length 162.6
  Top Layer w0.254: U0.72 98.24,58.51 105.09,51.66 105.09,30.71 106.59,29.21 167.66,29.21 172.41,33.96 172.41,57.29 171.61,58.09 171.61,77.54 167.04,82.11 167.04,86.11 167.59,86.66 RFID SPI 28.2
P74: length 130.8
  Top Layer w0.254: v2(97.97,31.8) 91.11,24.94 63.24,24.94 54.24,15.94 36.11,15.94 35.29,16.76 S5 26.1 31.51,13.01 36.09,8.44 R22.2 ; U0.74 98.31,59.51 105.76,52.06 v2(105.76,31.66)
  Bottom Layer w0.254: v2(97.97,31.8) 98.04,31.73 105.69,31.73 v2(105.76,31.66)
P75: length 129.3
  Top Layer w0.254: 5.5 131.22,51.12 132.81,52.71 138.24,52.71 141.17,49.77 141.17,38.77 143.56,36.39 157.19,36.39 S4 25.1 ; U0.75 98.61,60.01 109.46,49.16 123.19,49.16 124.74,47.61 v2(124.74,41.79)
  Bottom Layer w0.254: v2(124.74,41.79) 125.94,40.59 128.56,40.59 133.09,36.06 158.76,36.06 160.31,37.61 S4 25.1
P76: length 97.7
  Top Layer w0.254: 130.34,49.54 130.34,51.31 132.66,53.64 139.24,53.64 144.01,48.86 S3 24.1 ; U0.76 91.03,61.78 91.03,63.01 91.46,63.44 96.11,63.44 109.84,49.71 123.84,49.71 126.21,47.34 126.21,42.74 126.79,42.17 v2(126.79,42.04)
  Bottom Layer w0.254: v2(126.79,42.04) 129.11,42.04 134.49,36.66 142.01,36.66 144.01,38.66 S3 24.1
P77: length 161.9
  Top Layer w0.254: 5.7 129.54,51.74 134.49,56.69 151.64,56.69 152.44,55.89 157.11,55.89 158.14,56.91 158.14,58.64 158.92,59.42 165.9,59.42 167.86,57.46 167.86,44.66 S2 23.2 163.41,34.91 135.39,34.91 126.87,43.42 126.87,47.55 123.99,50.44 110.06,50.44 96.61,63.89 91.14,63.89 90.52,63.27 U0.77
P78: length 78.8
  Top Layer w0.254: U0.78 90.02,63.64 90.84,64.46 97.16,64.46 110.74,50.89 124.56,50.89 125.91,49.54 5.8 128.66,52.18 134.49,58.01 S1 22.1
P91: length 124.9
  Top Layer w0.254: U0.91 83.52,66.33 80.84,69.01 68.41,69.01 v2(68.34,68.94) ; 摇杆 XA5 XA6 Z39.2_VR2 10.61,36.01 20.24,45.64 28.49,45.64 30.09,44.04 30.09,37.11 34.19,33.01 52.99,33.01 66.26,46.29 v2(66.26,46.94)
  Bottom Layer w0.254: v2(68.34,68.94) 66.26,66.86 v2(66.26,46.94)
P92: length 112.6
  Top Layer w0.254: v2(65.09,46.94) 65.09,46.01 52.81,33.74 34.56,33.74 30.66,37.64 30.66,44.51 28.99,46.19 19.89,46.19 17.44,43.74 14.99,43.74 14.26,44.46 摇杆 XA5 XA6 Z39.2_VR1 ; U0.92 83.02,66.01 80.99,68.04 67.5,68.04 67.21,68.33 66.04,68.33 v2(66.04,68.34)
  Bottom Layer w0.254: v2(65.09,46.94) 65.09,67.39 v2(66.04,68.34)
P93: length 124.7
  Top Layer w0.254: U0.93 82.52,65.71 80.79,67.44 63.41,67.44 60.51,70.34 60.51,73.8 58.09,76.22 ; R2.2 14.69,72.39 13.31,73.76 13.31,76.91 15.81,79.41 15.81,113.39 16.84,114.41 25.09,114.41 26.21,113.29 26.21,104.64 28.01,102.84 35.01,102.84 44.49,93.36 47.14,93.36
P94: length 67.8
  Top Layer w0.254: v2(58.86,73.01) 59.05,73.01 59.7,72.36 59.7,70.25 63.11,66.84 80.59,66.84 82.02,65.41 U0.94 ; RP2.2 24.36,72.51 v1(26.71,72.51)
  Bottom Layer w0.254: v1(26.71,72.51) 30.01,72.51 32.04,70.49 48.86,70.49 51.39,73.01 v2(58.86,73.01)
P95: length 30.9
  Top Layer w0.355: 138.24,80.89 146.08,88.73 旋钮变阻器  A2.2 ; v2(81.09,75.96) 81.09,79.19 ; U0.95 81.52,63.73 81.19,64.06 81.14,64.06 v2(81.09,64.11)
  Bottom Layer w0.355: v2(81.09,64.11) v2(81.09,75.96)
P96: length 24.3
  Top Layer w0.254: U0.96 81.03,61.74 81.03,60.44 82.26,59.21 v2(88.81,59.21)
  Bottom Layer w0.254: 93.14,108.86 93.14,118.32 超声波.3
P97: length 25.6
  Top Layer w0.254: 80.52,60.33 U0.97 ; v2(89.61,58.51) 82.09,58.51 80.52,60.08 80.52,60.33
  Bottom Layer w0.254: 超声波.2 91.98,120.37 93.84,118.51 93.84,108.56
SCK: length 146.9
  Top Layer w0.254: SD卡  SPI   4.5 11.31,18.59 10.21,19.69 8.26,19.69 7.74,20.21 7.74,21.4 R12.1 7.82,22.89 9.76,24.84 25.86,24.84 28.21,22.49 43.41,22.49 71.26,50.34 v1(71.26,50.44) 71.32,50.49 77.25,50.49 U0.20 ; 169.04,99.39 RFID SPI 28.7 167.71,99.36 159.81,91.46 ; JP3.2 19.67,117.18 20.26,116.59 26.11,116.59 28.51,114.19 28.51,110.89 30.51,108.89 36.59,108.89
  Bottom Layer w0.254: ICSP.3 170.24,111.35 170.24,106.41 171.56,105.09 171.56,100.76 170.35,99.55 169.2,99.55 RFID SPI 28.7
SCL: length 193.6
  Top Layer w0.254: 89.41,39.16 89.46,39.21 RN3.2 ; 89.41,39.16 86.01,39.16 85.24,39.94 85.24,42.44 87.52,44.72 U0.43 ; 89.41,39.16 90.59,39.16 91.29,39.86 91.29,41.46 91.64,41.81 U4.14 ; JP5.3 44.19,123.87 31.54,123.87 ; 37.59,110.14 31.19,110.14 29.99,111.34 29.99,114.99 26.96,118.01 26.96,123.49 27.35,123.87 31.54,123.87 ; 31.54,123.87 JP4.3 ; TM1.2 118.74,107.58 118.74,109.01 v2(118.76,109.04) ; 118.56,95.44 v2(118.66,95.54)
  Bottom Layer w0.254: 135.62,45.74 135.67,45.79 136.59,45.79 ; 135.62,45.74 138.06,45.74 139.36,47.04 139.36,79.54 136.99,81.91 126.99,81.91 118.66,90.24 v2(118.66,95.54) 118.71,95.59 118.71,108.99 v2(118.76,109.04) ; 135.62,45.74 触摸屏.10 134.14,44.26 91.34,44.26 90.39,43.31 90.39,42.34 v1(91.26,41.46)
SDA: length 177.5
  Top Layer w0.254: U4.13 89.78,42.91 89.46,42.59 ; JP4.4 29,117.17 30.69,115.49 30.69,111.59 31.51,110.76 37.96,110.76 ; 119.57,96.37 v2(119.66,96.46) ; U0.44 88.02,43.95 88.95,43.02 89.14,43.02 89.46,42.7 89.46,42.59 ; TM1.3 117.41,107.58 117.41,109.01 v2(117.39,109.04) ; RN4.2 89.46,42.59
  Bottom Layer w0.254: v2(117.39,109.04) 117.39,109.96 118.06,110.64 119.11,110.64 119.66,110.09 v2(119.66,96.46) 119.66,90.56 127.54,82.69 137.91,82.69 140.49,80.11 140.49,45.61 137.97,43.09 触摸屏.9 135.43,43.01 91.31,43.01 v1(91.24,42.94) ; JP4.4 30.93,120.09 41.59,120.09 JP5.4
